# EAGLE design Hocki-Control (EAGLE 9.6.2)
Integrates sensors and microcontroller for battlebot Hocki
REVISION: 1.0; SCH_DESC: Control Board for Hocki Battlebot; TEAM: BattleBots

## Sheet 1 of 4: MCU, I/O, Power
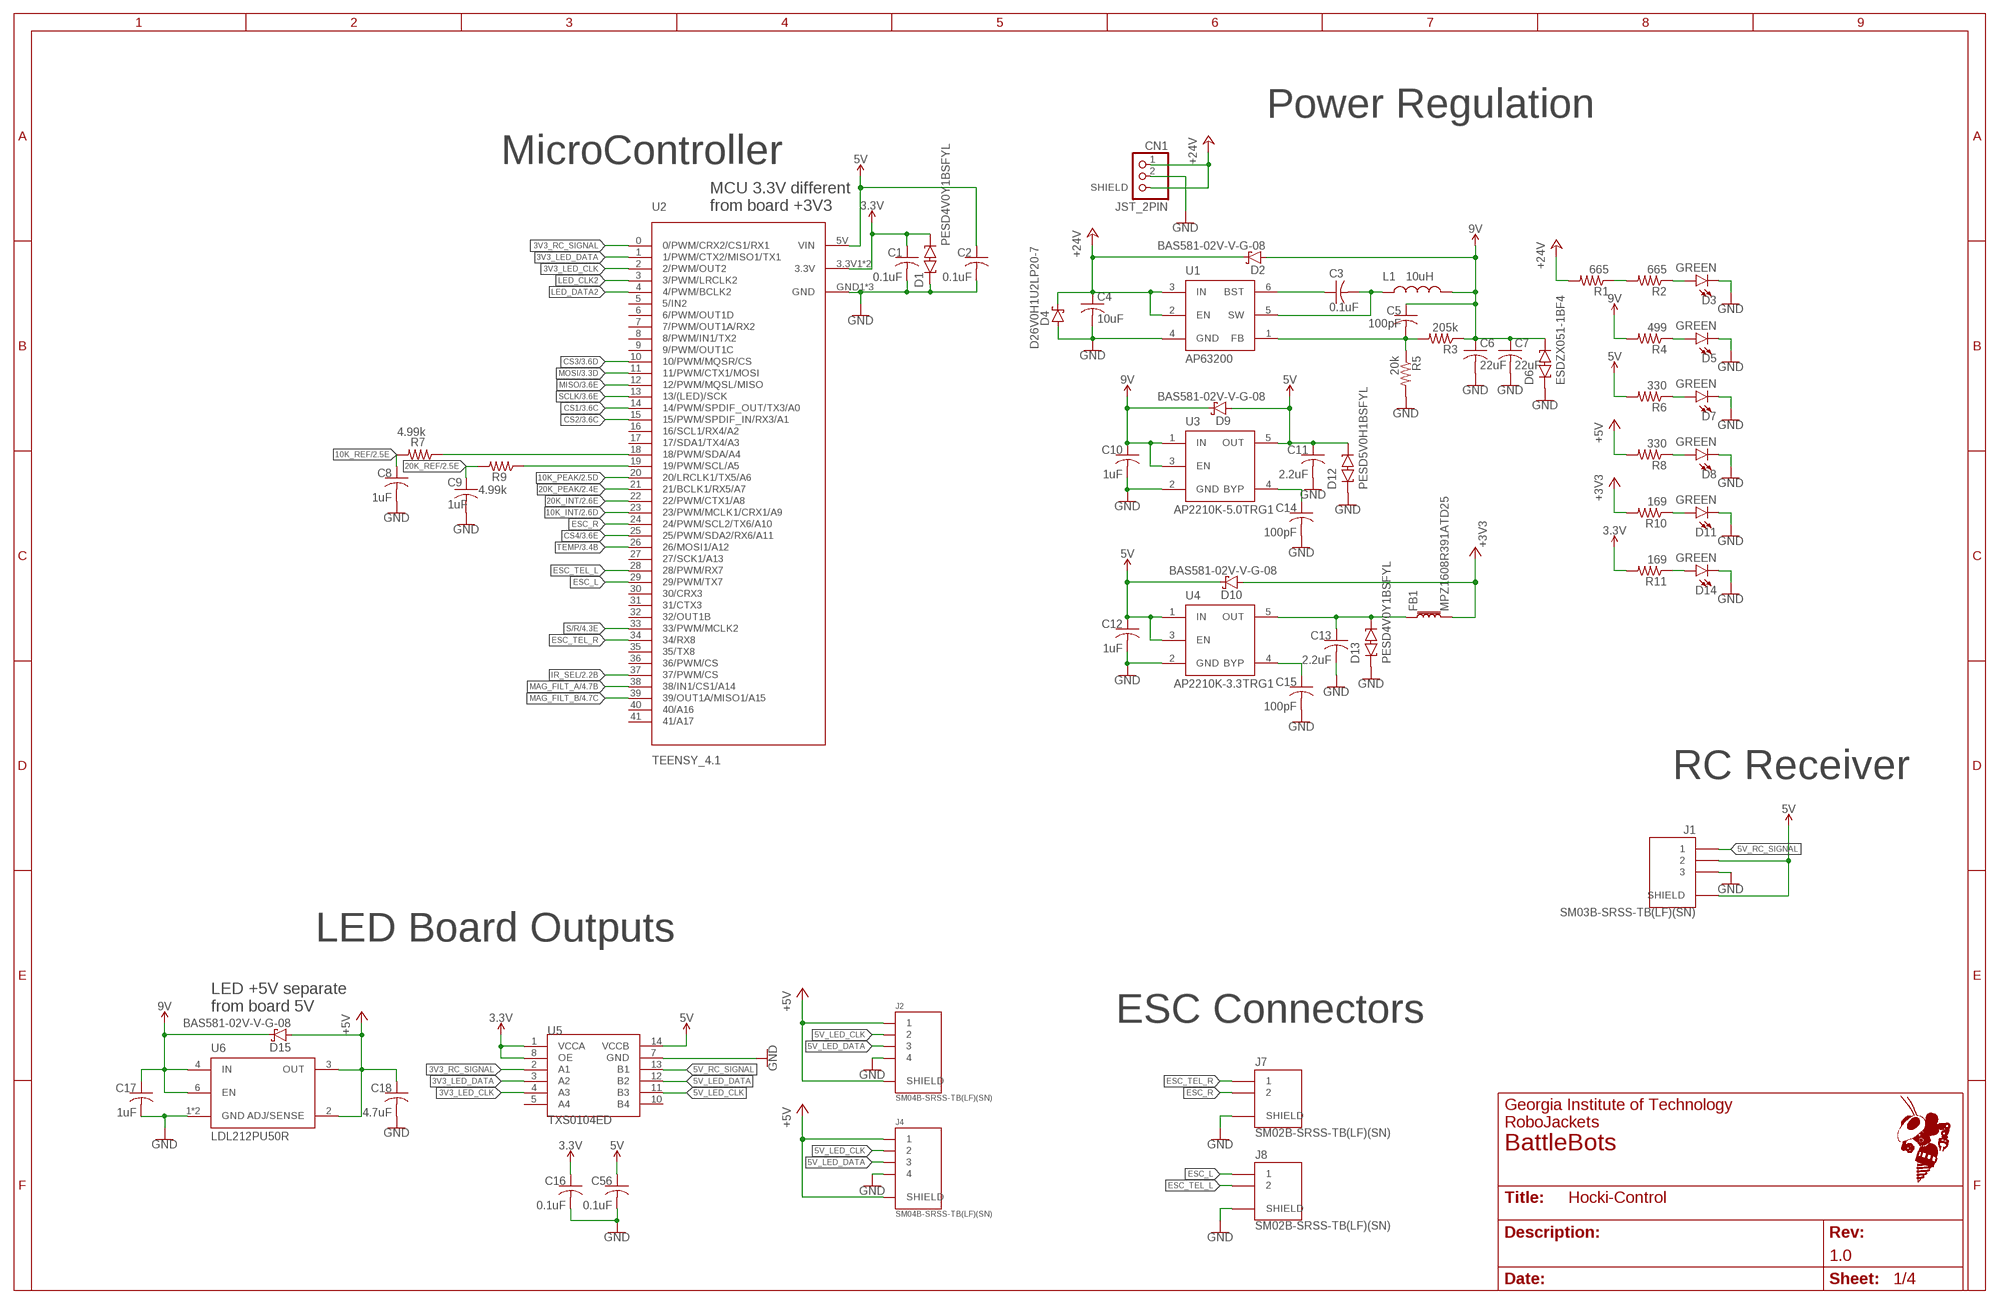
[diagram p0: schematic, sheet 1]

### Parts
C1  0.1uF  C-USC0603  [C0603]
C2  0.1uF  C-USC0603  [C0603]
C3  0.1uF  C-USC0603  [C0603]
C4  10uF  C-USC1206  [C1206]
C5  100pF  C-USC0603  [C0603]
C6  22uF  C-USC1206  [C1206]
C7  22uF  C-USC1206  [C1206]
C8  1uF  C-USC0603  [C0603]
C9  1uF  C-USC0603  [C0603]
C10  1uF  C-USC0603  [C0603]
C11  2.2uF  C-USC0603  [C0603]
C12  1uF  C-USC0603  [C0603]
C13  2.2uF  C-USC0603  [C0603]
C14  100pF  C-USC0603  [C0603]
C15  100pF  C-USC0603  [C0603]
C16  0.1uF  C-USC0603  [C0603]
C17  1uF  C-USC0603  [C0603]
C18  4.7uF  C-USC0603  [C0603]
C56  0.1uF  C-USC0603  [C0603]
CN1  JST_2PIN  [JST-PH-2-SMT]
D1  PESD4V0Y1BSFYL  [DSN0603-2]
D2  BAS581-02V-V-G-08  [SOD-523]
D3  GREEN  LED-GREEN0603  [LED-0603]
D4  D26V0H1U2LP20-7  [D26V0H1U2LP20-7]
D5  GREEN  LED-GREEN0603  [LED-0603]
D6  ESDZX051-1BF4  [DSN0603-2]
D7  GREEN  LED-GREEN0603  [LED-0603]
D8  GREEN  LED-GREEN0603  [LED-0603]
D9  BAS581-02V-V-G-08  [SOD-523]
D10  BAS581-02V-V-G-08  [SOD-523]
D11  GREEN  LED-GREEN0603  [LED-0603]
D12  PESD5V0H1BSFYL  [DSN0603-2]
D13  PESD4V0Y1BSFYL  [DSN0603-2]
D14  GREEN  LED-GREEN0603  [LED-0603]
D15  BAS581-02V-V-G-08  [SOD-523]
FB1  MPZ1608R391ATD25  [0603]
J1  SM03B-SRSS-TB(LF)(SN)  [SM03B-SRSS-TB(LF)(SN)]
J2  SM04B-SRSS-TB(LF)(SN)  [SM04B-SRSS-TB(LF)(SN)]
J4  SM04B-SRSS-TB(LF)(SN)  [SM04B-SRSS-TB(LF)(SN)]
J7  SM02B-SRSS-TB(LF)(SN)  [SM02B-SRSS-TB(LF)(SN)]
J8  SM02B-SRSS-TB(LF)(SN)  [SM02B-SRSS-TB(LF)(SN)]
L1  10uH  LQH5BPN100M38L  [LQH5BPN100M38L]
R1  665  R-US_R0603  [R0603]
R2  665  R-US_R0603  [R0603]
R3  205k  R-US_R0603  [R0603]
R4  499  R-US_R0603  [R0603]
R5  20k  R-US_R0603  [R0603]
R6  330  R-US_R0603  [R0603]
R7  4.99k  R-US_R0603  [R0603]
R8  330  R-US_R0603  [R0603]
R9  4.99k  R-US_R0603  [R0603]
R10  169  R-US_R0603  [R0603]
R11  169  R-US_R0603  [R0603]
U1  AP63200  [SOT-23-6]
U2  TEENSY_4.1  [TEENSY_4.1]
U3  AP2210K-5.0TRG1  [SOT-23-5]
U4  AP2210K-3.3TRG1  [SOT-23-5]
U5  TXS0104ED  [14-SOIC]
U6  LDL212PU50R  [DFN6(3X3)]

### Nets
3.3V: C1.1 C16.1 D1.C2 R11.2 U2.3.3V1(3.3V) U2.3.3V2(3.3V) U5.1(VCCA) U5.8(OE) ; also sheet 2,3
3V3_LED_CLK: U2.2(2/PWM/OUT2) U5.4(A3)
3V3_LED_DATA: U2.1(1/PWM/CTX2/MISO1/TX1) U5.3(A2)
3V3_RC_SIGNAL: U2.0(0/PWM/CRX2/CS1/RX1) U5.2(A1)
5V: C2.1 C11.1 C12.1 C56.1 D9.2(A) D10.1(C) D12.C2 J1.2 J1.S1(SHIELD) J1.S2(SHIELD) R6.2 U2.5V(VIN) U3.5(OUT) U4.1(IN) U4.3(EN) U5.14(VCCB) ; also sheet 2
5V_LED_CLK: J2.2 J4.2 U5.11(B3)
5V_LED_DATA: J2.3 J4.3 U5.12(B2)
5V_RC_SIGNAL: J1.1 U5.13(B1)
9V: C5.1 C6.1 C7.1 C10.1 C17.1 D2.2(A) D6.C2 D9.1(C) D15.1(C) L1.2 R3.1 R4.2 U3.1(IN) U3.3(EN) U6.4(IN) U6.6(EN) ; also sheet 2
10K_INT: U2.23(23/PWM/MCLK1/CRX1/A9) ; also sheet 2
10K_PEAK: U2.20(20/LRCLK1/TX5/A6) ; also sheet 2
10K_REF: C8.1 R7.2 ; also sheet 2
20K_INT: U2.22(22/PWM/CTX1/A8) ; also sheet 2
20K_PEAK: U2.21(21/BCLK1/RX5/A7) ; also sheet 2
20K_REF: C9.1 R9.2 ; also sheet 2
+3V3: D10.2(A) FB1.2 R10.2 ; also sheet 4
+5V: C18.1 D15.2(A) J2.1 J2.S1(SHIELD) J2.S2(SHIELD) J4.1 J4.S1(SHIELD) J4.S2(SHIELD) R8.2 U6.2(ADJ/SENSE) U6.3(OUT)
+24V: C4.1 CN1.1 CN1.NC1(SHIELD) CN1.NC2(SHIELD) D2.1(C) D4.1(C) R1.2 U1.2(EN) U1.3(IN)
CS1: U2.14(14/PWM/SPDIF_OUT/TX3/A0) ; also sheet 3
CS2: U2.15(15/PWM/SPDIF_IN/RX3/A1) ; also sheet 3
CS3: U2.10(10/PWM/MQSR/CS) ; also sheet 3
CS4: U2.25(25/PWM/SDA2/RX6/A11) ; also sheet 3
ESC_L: J8.1 U2.29(29/PWM/TX7)
ESC_R: J7.2 U2.24(24/PWM/SCL2/TX6/A10)
ESC_TEL_L: J8.2 U2.28(28/PWM/RX7)
ESC_TEL_R: J7.1 U2.34(34/RX8)
GND: C1.2 C2.2 C4.2 C6.2 C7.2 C8.2 C9.2 C10.2 C11.2 C12.2 C13.2 C14.2 C15.2 C16.2 C17.2 C18.2 C56.2 CN1.2 D1.C1 D3.C D4.2(A) D5.C D6.C1 D7.C D8.C D11.C D12.C1 D13.C1 D14.C J1.3 J2.4 J4.4 J7.S1(SHIELD) J7.S2(SHIELD) J8.S1(SHIELD) J8.S2(SHIELD) R5.2 U1.4(GND) U2.GND1(GND) U2.GND2(GND) U2.GND3(GND) U3.2(GND) U4.2(GND) U5.7(GND) U6.1(GND) U6.7(GND) ; also sheet 2,3,4
IR_SEL: U2.37(37/PWM/CS) ; also sheet 2
LED_CLK2: U2.3(3/PWM/LRCLK2)
LED_DATA2: U2.4(4/PWM/BCLK2)
MAG_FILT_A: U2.38(38/IN1/CS1/A14) ; also sheet 4
MAG_FILT_B: U2.39(39/OUT1A/MISO1/A15) ; also sheet 4
MISO: U2.12(12/PWM/MQSL/MISO) ; also sheet 3
MOSI: U2.11(11/PWM/CTX1/MOSI) ; also sheet 3
N$1: C3.1 U1.6(BST)
N$3: C3.2 L1.1 U1.5(SW)
N$8: C14.1 U3.4(BYP)
N$11: C15.1 U4.4(BYP)
N$12: C5.2 R3.2 R5.1 U1.1(FB)
N$14: D8.A R8.1
N$15: D7.A R6.1
N$17: D11.A R10.1
N$18: D5.A R4.1
N$19: D3.A R2.1
N$20: R1.1 R2.2
N$21: R7.1 U2.18(18/PWM/SDA/A4)
N$22: R9.1 U2.19(19/PWM/SCL/A5)
N$27: D14.A R11.1
N$28: C13.1 D13.C2 FB1.1 U4.5(OUT)
S/R: U2.33(33/PWM/MCLK2) ; also sheet 4
SCLK: U2.13(13/(LED)/SCK) ; also sheet 3
TEMP: U2.26(26/MOSI1/A12) ; also sheet 3
Unconnected: U2.5(5/IN2) U2.6(6/PWM/OUT1D) U2.7(7/PWM/OUT1A/RX2) U2.8(8/PWM/IN1/TX2) U2.9(9/PWM/OUT1C) U2.16(16/SCL1/RX4/A2) U2.17(17/SDA1/TX4/A3) U2.27(27/SCK1/A13) U2.30(30/CRX3) U2.31(31/CTX3) U2.32(32/OUT1B) U2.35(35/TX8) U2.36(36/PWM/CS) U2.40(40/A16) U2.41(41/A17) U5.5(A4) U5.10(B4)

### Notes on the sheet
- Power Regulation
- MicroController
- MCU 3.3V different
  from board +3V3
- RC Receiver
- LED Board Outputs
- LED +5V separate
  from board 5V
- ESC Connectors

## Sheet 2 of 4: IR Filtering
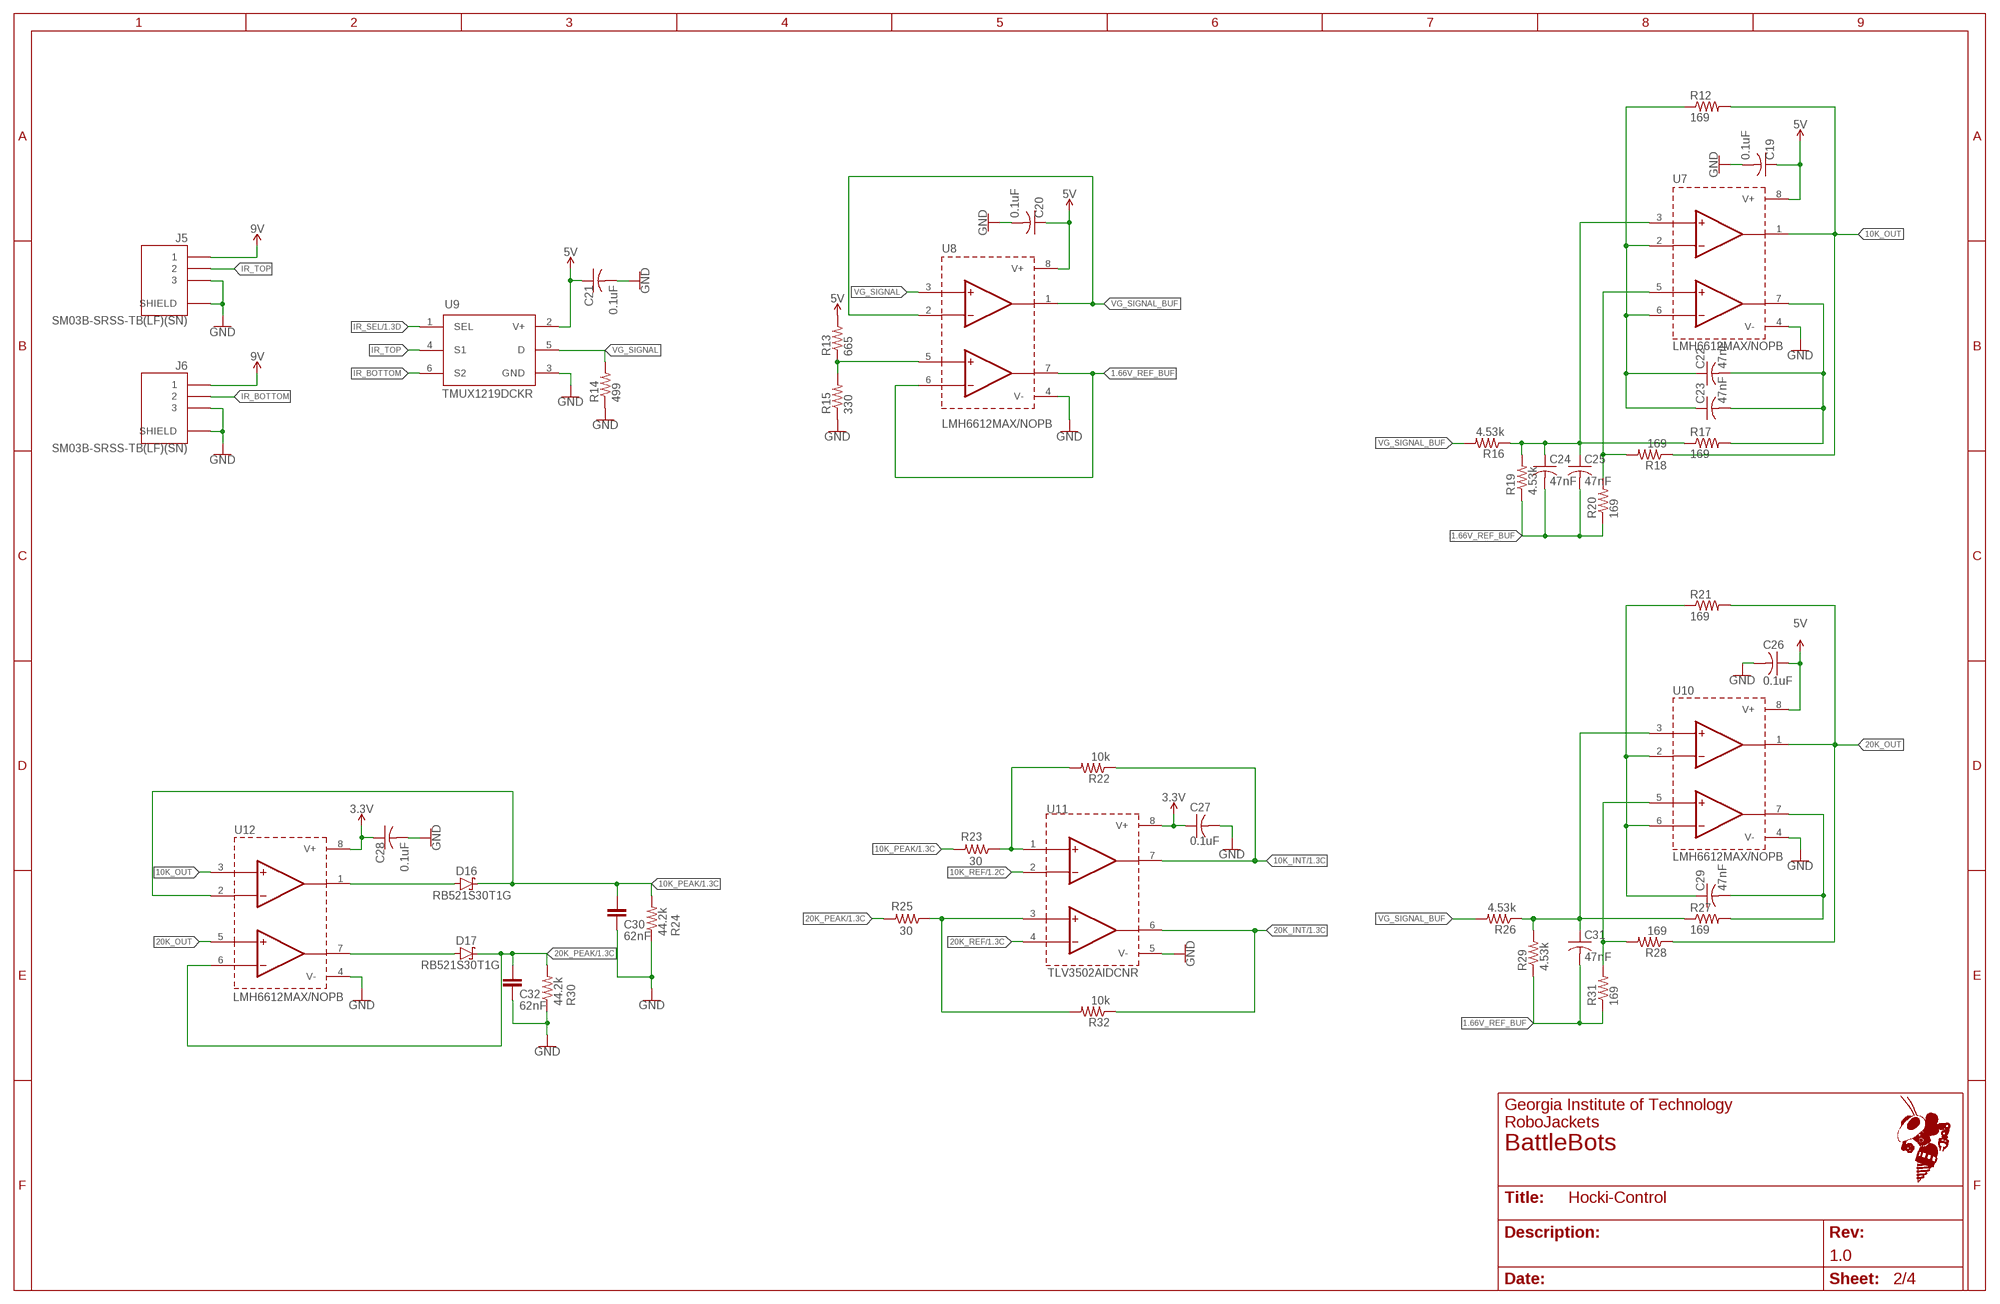
[diagram p1: schematic, sheet 2]

### Parts
C19  0.1uF  C-USC0603  [C0603]
C20  0.1uF  C-USC0603  [C0603]
C21  0.1uF  C-USC0603  [C0603]
C22  47nF  C-USC1206  [C1206]
C23  47nF  C-USC1206  [C1206]
C24  47nF  C-USC1206  [C1206]
C25  47nF  C-USC1206  [C1206]
C26  0.1uF  C-USC0603  [C0603]
C27  0.1uF  C-USC0603  [C0603]
C28  0.1uF  C-USC0603  [C0603]
C29  47nF  C-USC1206  [C1206]
C30  62nF  BFC241646203  [BFC241646203]
C31  47nF  C-USC1206  [C1206]
C32  62nF  BFC241646203  [BFC241646203]
D16  RB521S30T1G  [SOD-523]
D17  RB521S30T1G  [SOD-523]
J5  SM03B-SRSS-TB(LF)(SN)  [SM03B-SRSS-TB(LF)(SN)]
J6  SM03B-SRSS-TB(LF)(SN)  [SM03B-SRSS-TB(LF)(SN)]
R12  169  R-US_R0603  [R0603]
R13  665  R-US_R0603  [R0603]
R14  499  R-US_R0603  [R0603]
R15  330  R-US_R0603  [R0603]
R16  4.53k  R-US_R0603  [R0603]
R17  169  R-US_R0603  [R0603]
R18  169  R-US_R0603  [R0603]
R19  4.53k  R-US_R0603  [R0603]
R20  169  R-US_R0603  [R0603]
R21  169  R-US_R0603  [R0603]
R22  10k  R-US_R0603  [R0603]
R23  30  R-US_R0603  [R0603]
R24  44.2k  R-US_R0603  [R0603]
R25  30  R-US_R0603  [R0603]
R26  4.53k  R-US_R0603  [R0603]
R27  169  R-US_R0603  [R0603]
R28  169  R-US_R0603  [R0603]
R29  4.53k  R-US_R0603  [R0603]
R30  44.2k  R-US_R0603  [R0603]
R31  169  R-US_R0603  [R0603]
R32  10k  R-US_R0603  [R0603]
U7  LMH6612MAX/NOPB  [8-SOIC]
U8  LMH6612MAX/NOPB  [8-SOIC]
U9  TMUX1219DCKR  [SOT-363]
U10  LMH6612MAX/NOPB  [8-SOIC]
U11  TLV3502AIDCNR  [SOT-23-8]
U12  LMH6612MAX/NOPB  [8-SOIC]

### Nets
1.6V_REF: R13.1 R15.2 U8.5(INB+)
1.66V_REF_BUF: C24.2 C25.2 C31.2 R19.1 R20.1 R29.1 R31.1 U8.6(INB-) U8.7(OUTB)
3.3V: C27.1 C28.1 U11.8(V+) U12.8(V+) ; also sheet 1,3
5V: C19.1 C20.1 C21.1 C26.1 R13.2 U7.8(V+) U8.8(V+) U9.2(V+) U10.8(V+) ; also sheet 1
9V: J5.1 J6.1 ; also sheet 1
10K_FB: C22.2 C23.2 R17.2 U7.7(OUTB)
10K_IN: C24.1 C25.1 R16.1 R17.1 R19.2 U7.3(INA+)
10K_INT: R22.1 U11.7(OUTA) ; also sheet 1
10K_OUT: R12.2 R18.1 U7.1(OUTA) U12.3(INA+)
10K_PEAK: C30.1 D16.1(C) R23.2 R24.2 U12.2(INA-) ; also sheet 1
10K_REF: U11.2(INA-) ; also sheet 1
20K_FB: C29.2 R27.2 U10.7(OUTB)
20K_IN: C31.1 R26.1 R27.1 R29.2 U10.3(INA+)
20K_INT: R32.1 U11.6(OUTB) ; also sheet 1
20K_OUT: R21.2 R28.1 U10.1(OUTA) U12.5(INB+)
20K_PEAK: C32.1 D17.1(C) R25.2 R30.2 U12.6(INB-) ; also sheet 1
20K_REF: U11.4(INB-) ; also sheet 1
GND: C19.2 C20.2 C21.2 C26.2 C27.2 C28.2 C30.2 C32.2 J5.3 J5.S1(SHIELD) J5.S2(SHIELD) J6.3 J6.S1(SHIELD) J6.S2(SHIELD) R14.1 R15.1 R24.1 R30.1 U7.4(V-) U8.4(V-) U9.3(GND) U10.4(V-) U11.5(V-) U12.4(V-) ; also sheet 1,3,4
IR_BOTTOM: J6.2 U9.6(S2)
IR_SEL: U9.1(SEL) ; also sheet 1
IR_TOP: J5.2 U9.4(S1)
N$2: D16.2(A) U12.1(OUTA)
N$4: C22.1 C23.1 R12.1 U7.2(INA-) U7.6(INB-)
N$5: R22.2 R23.1 U11.1(INA+)
N$6: R25.1 R32.2 U11.3(INB+)
N$7: R18.2 R20.2 U7.5(INB+)
N$9: D17.2(A) U12.7(OUTB)
N$10: C29.1 R21.1 U10.2(INA-) U10.6(INB-)
N$13: R28.2 R31.2 U10.5(INB+)
VG_SIGNAL: R14.2 U8.3(INA+) U9.5(D)
VG_SIGNAL_BUF: R16.2 R26.2 U8.1(OUTA) U8.2(INA-)

## Sheet 3 of 4: Accelerometers
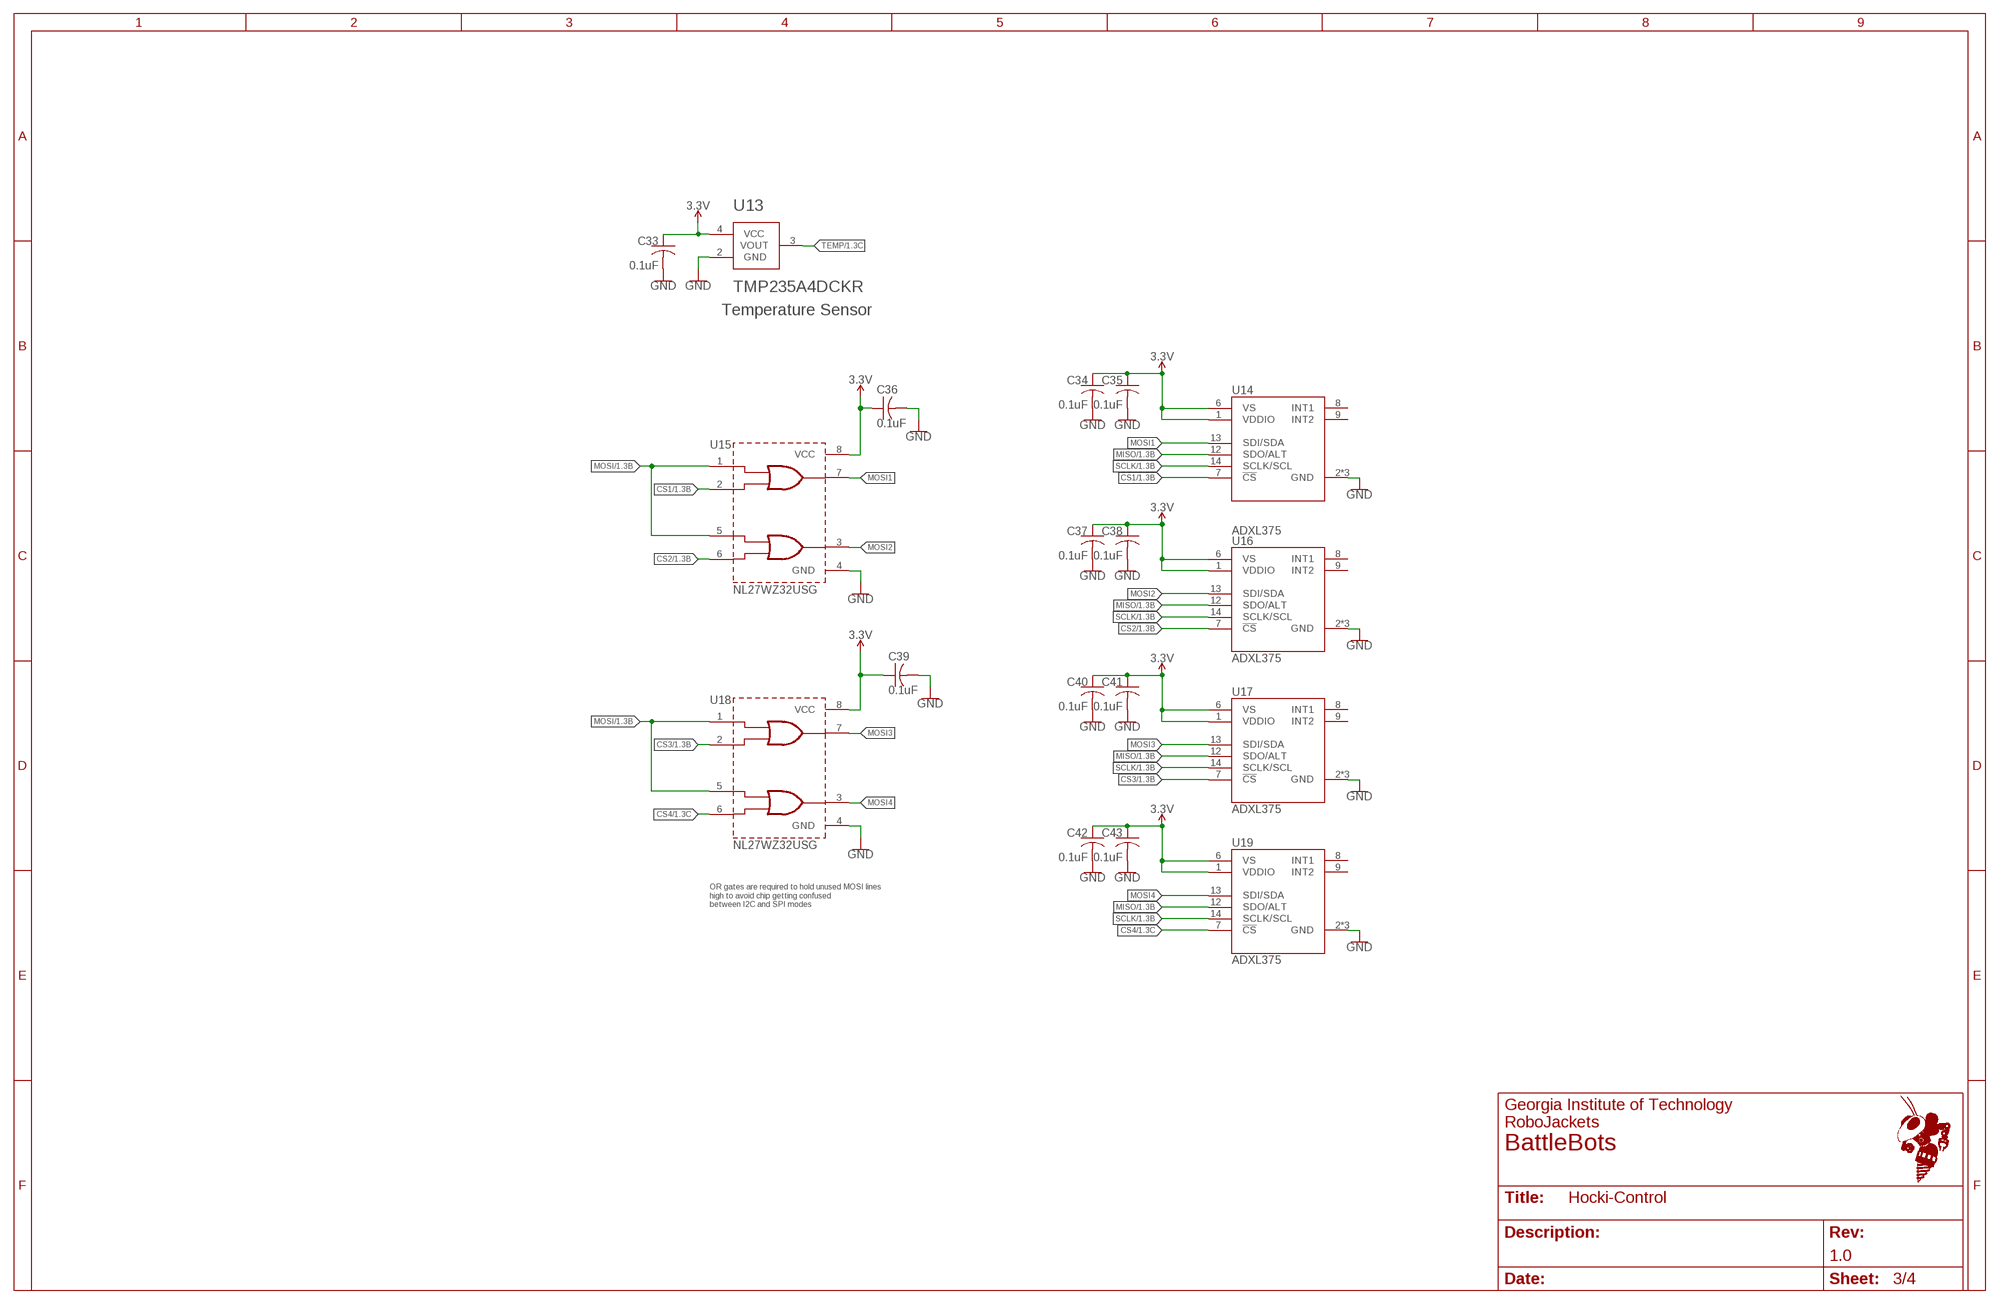
[diagram p2: schematic, sheet 3]

### Parts
C33  0.1uF  C-USC0603  [C0603]
C34  0.1uF  C-USC0603  [C0603]
C35  0.1uF  C-USC0603  [C0603]
C36  0.1uF  C-USC0603  [C0603]
C37  0.1uF  C-USC0603  [C0603]
C38  0.1uF  C-USC0603  [C0603]
C39  0.1uF  C-USC0603  [C0603]
C40  0.1uF  C-USC0603  [C0603]
C41  0.1uF  C-USC0603  [C0603]
C42  0.1uF  C-USC0603  [C0603]
C43  0.1uF  C-USC0603  [C0603]
U13  TMP235A4DCKR  [SOT-353]
U14  ADXL375  [14-LGA]
U15  NL27WZ32USG  [US8]
U16  ADXL375  [14-LGA]
U17  ADXL375  [14-LGA]
U18  NL27WZ32USG  [US8]
U19  ADXL375  [14-LGA]

### Nets
3.3V: C33.1 C34.1 C35.1 C36.1 C37.1 C38.1 C39.1 C40.1 C41.1 C42.1 C43.1 U13.4(VCC) U14.1(VDDIO) U14.6(VS) U15.8(VCC) U16.1(VDDIO) U16.6(VS) U17.1(VDDIO) U17.6(VS) U18.8(VCC) U19.1(VDDIO) U19.6(VS) ; also sheet 1,2
CS1: U14.7(!CS) U15.2(B1) ; also sheet 1
CS2: U15.6(B2) U16.7(!CS) ; also sheet 1
CS3: U17.7(!CS) U18.2(B1) ; also sheet 1
CS4: U18.6(B2) U19.7(!CS) ; also sheet 1
GND: C33.2 C34.2 C35.2 C36.2 C37.2 C38.2 C39.2 C40.2 C41.2 C42.2 C43.2 U13.2(GND) U14.2(GND) U14.4(GND) U14.5(GND) U15.4(GND) U16.2(GND) U16.4(GND) U16.5(GND) U17.2(GND) U17.4(GND) U17.5(GND) U18.4(GND) U19.2(GND) U19.4(GND) U19.5(GND) ; also sheet 1,2,4
MISO: U14.12(SDO/ALT) U16.12(SDO/ALT) U17.12(SDO/ALT) U19.12(SDO/ALT) ; also sheet 1
MOSI: U15.1(A1) U15.5(A2) U18.1(A1) U18.5(A2) ; also sheet 1
MOSI1: U14.13(SDI/SDA) U15.7(Y1)
MOSI2: U15.3(Y2) U16.13(SDI/SDA)
MOSI3: U17.13(SDI/SDA) U18.7(Y1)
MOSI4: U18.3(Y2) U19.13(SDI/SDA)
SCLK: U14.14(SCLK/SCL) U16.14(SCLK/SCL) U17.14(SCLK/SCL) U19.14(SCLK/SCL) ; also sheet 1
TEMP: U13.3(VOUT) ; also sheet 1
Unconnected: U14.8(INT1) U14.9(INT2) U16.8(INT1) U16.9(INT2) U17.8(INT1) U17.9(INT2) U19.8(INT1) U19.9(INT2)

### Notes on the sheet
- Temperature Sensor
- OR gates are required to hold unused MOSI lines 
  high to avoid chip getting confused 
  between I2C and SPI modes

## Sheet 4 of 4: Magnetometer
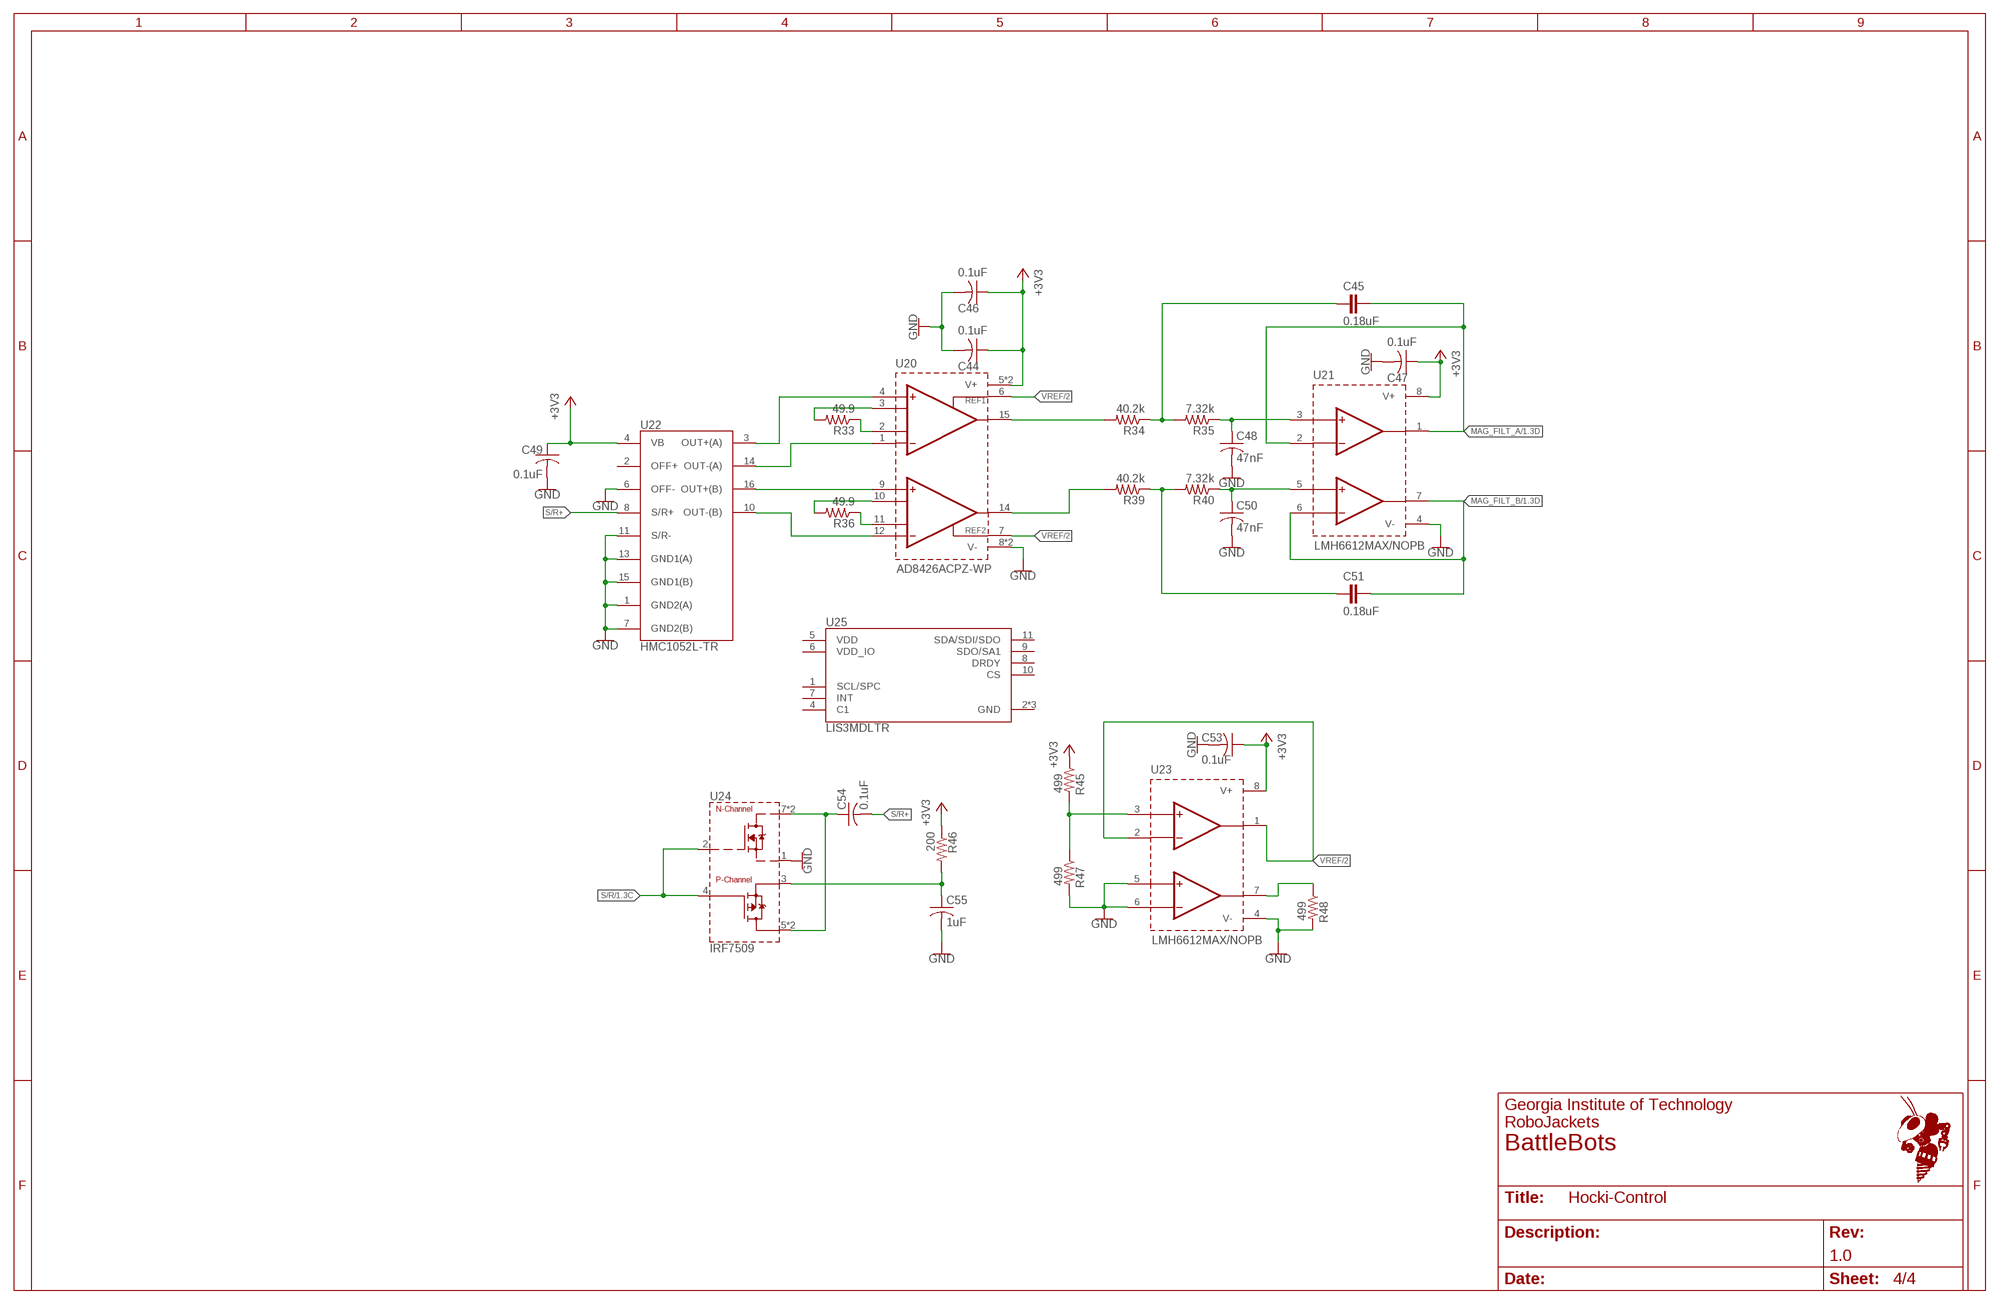
[diagram p3: schematic, sheet 4]

### Parts
C44  0.1uF  C-USC0603  [C0603]
C45  0.18uF  ECH-U1H184GX9  [ECH-U1H184GX9]
C46  0.1uF  C-USC0603  [C0603]
C47  0.1uF  C-USC0603  [C0603]
C48  47nF  C-USC1206  [C1206]
C49  0.1uF  C-USC0603  [C0603]
C50  47nF  C-USC1206  [C1206]
C51  0.18uF  ECH-U1H184GX9  [ECH-U1H184GX9]
C53  0.1uF  C-USC0603  [C0603]
C54  0.1uF  C-USC0603  [C0603]
C55  1uF  C-USC0603  [C0603]
R33  49.9  R-US_R0603  [R0603]
R34  40.2k  R-US_R0603  [R0603]
R35  7.32k  R-US_R0603  [R0603]
R36  49.9  R-US_R0603  [R0603]
R39  40.2k  R-US_R0603  [R0603]
R40  7.32k  R-US_R0603  [R0603]
R45  499  R-US_R0603  [R0603]
R46  200  R-US_R0603  [R0603]
R47  499  R-US_R0603  [R0603]
R48  499  R-US_R0603  [R0603]
U20  AD8426ACPZ-WP  [16LFCSP]
U21  LMH6612MAX/NOPB  [8-SOIC]
U22  HMC1052L-TR  [16-LCC]
U23  LMH6612MAX/NOPB  [8-SOIC]
U24  IRF7509  [MICRO8]
U25  LIS3MDLTR  [LGA-12_2X2X1_STM]

### Nets
+3V3: C44.1 C46.1 C47.1 C49.1 C53.1 R45.1 R46.1 U20.5(V+) U20.16(V+) U21.8(V+) U22.4(VB) U23.8(V+) ; also sheet 1
GND: C44.2 C46.2 C47.2 C48.2 C49.2 C50.2 C53.2 C55.2 R47.2 R48.2 U20.8(V-) U20.13(V-) U21.4(V-) U22.1(GND2(A)) U22.6(OFF-) U22.7(GND2(B)) U22.11(S/R-) U22.13(GND1(A)) U22.15(GND1(B)) U23.4(V-) U23.5(INB+) U23.6(INB-) U24.1(S1) ; also sheet 1,2,3
MAG_FILT_A: C45.2 U21.1(OUTA) U21.2(INA-) ; also sheet 1
MAG_FILT_B: C51.2 U21.6(INB-) U21.7(OUTB) ; also sheet 1
N$16: C54.1 U24.5(D2) U24.6(D2) U24.7(D1) U24.8(D1)
N$23: R45.2 R47.1 U23.3(INA+)
N$24: R48.1 U23.7(OUTB)
N$25: C45.1 R34.1 R35.2
N$26: C48.1 R35.1 U21.3(INA+)
N$29: C51.1 R39.1 R40.2
N$30: C50.1 R40.1 U21.5(INB+)
N$31: U20.4(INA+) U22.3(OUT+(A))
N$32: U20.1(INA-) U22.14(OUT-(A))
N$33: U20.9(INB+) U22.16(OUT+(B))
N$34: U20.12(INB-) U22.10(OUT-(B))
N$35: R39.2 U20.14(OUTB)
N$36: R34.2 U20.15(OUTA)
N$37: R33.2 U20.3(RGA+)
N$38: R33.1 U20.2(RGA-)
N$39: R36.2 U20.10(RGB+)
N$40: R36.1 U20.11(RGB-)
S/R: U24.2(G1) U24.4(G2) ; also sheet 1
S/R+: C54.2 U22.8(S/R+)
VREF/2: U20.6(REFA) U20.7(REFB) U23.1(OUTA) U23.2(INA-)
VSR: C55.1 R46.2 U24.3(S2)
Unconnected: U22.2(OFF+) U25.1(SCL/SPC) U25.2(GND) U25.3(GND) U25.4(C1) U25.5(VDD) U25.6(VDD_IO) U25.7(INT) U25.8(DRDY) U25.9(SDO/SA1) U25.10(CS) U25.11(SDA/SDI/SDO) U25.12(GND)

## Library data of the parts
C1-C29 C31 C33-C44 C46-C50 C53-C56 = rcl:C-US: CAPACITOR, American symbol; SPICEPREFIX: C
C30 C32 = Hocki_Library:BFC241646203: 0.062µF Film Capacitor 25V 63V Polypropylene (PP), Metallized Radial DigiKey <https://www.digikey.com/product-detail/en/vishay-bc-components/BFC241646203/BC2071-ND/502851>; DKPN: BC2071-ND; VALUE: 62n
C45 C51 = Hocki_Library:ECH-U1H184GX9: 0.18µF Film Capacitor 50V Polyphenylene Sulfide (PPS), Metallized - Stacked 2416 (6041 Metric) DigiKey <https://www.digikey.com/product-detail/en/panasonic-electronic-components/ECH-U1H184GX9/PCF1555CT-ND/1630918>; DKPN: PCF1555CT-ND; VALUE: 0.18u
CN1 = Hocki_Library:JST_2PIN: JST 2-Pin Connectors of various flavors SMT-RA (S2B-PH-SM4) 4UConnector #17311 SMT (B2B-PH-SM4) THM-RA (S2B-PH) THM (B2B-PH)
D1 D13 = Hocki_Library:PESD4V0Y1BSFYL: 3.7V (Typ) Clamp Ipp Tvs Diode Surface Mount DSN0603-2 DigiKey <https://www.digikey.com/product-detail/en/nexperia-usa-inc/PESD4V0Y1BSFYL/1727-7840-1-ND/9326518>; DKPN: 1727-7840-1-ND
D2 D9 D10 D15 = Hocki_Library:BAS581-02V-V-G-08: Diode Schottky 40V 200mA Surface Mount SOD-523 DigiKey <https://www.digikey.com/product-detail/en/vishay-semiconductor-diodes-division/BAS581-02V-V-G-08/112-BAS581-02V-V-G-08CT-ND/8564684>; DKPN: 112-BAS581-02V-V-G-08CT-ND
D3 D5 D7 D8 D11 D14 = SparkFun-LED:LED-GREEN: Green SMD LED Used in manufacturing of various products at SparkFun Packages: 0603 - SMD 0603 package [Product Link] <http://www.futureelectronics.com/en/technologies/semiconductors/optoelectronics/leds/Pages/9894312-LTST-C190GKT.aspx?CrossPart=HSMG-C190&IM=0> LilyPad 1206 - SMD1206 LilyPad package [Product Link] <http://www.futureelectronics.com/en/Technologies/Product.aspx?ProductID=IN150NGHARVATEKCORPORATION2049943&IM=0> 1206 - SMD1206 package [Product Link] <http://www.futureelectronics.com/en/technologies/semiconductors/optoelectronics/leds/Pages/8315665-LTST-C150KGKT.aspx?IM=0> 1206 Bottom Mount -SMD 1206 Bottom Mount [Product Link] <http://www.digikey.com/product-detail/en/lite-on-inc/LTST-C230KGKT/160-1456-1-ND/386854> SparkFun Products: Pro Mini 328 -5V <https://www.sparkfun.com/products/821> RedBoard <https://www.sparkfun.com/products/12757> MP3 Trigger <https://www.sparkfun.com/products/13720> Makey Makey <https://www.sparkfun.com/products/11076>; PROD_ID: DIO-00821
D4 = Hocki_Library:D26V0H1U2LP20-7: 40V Clamp 9.5A Ipp Tvs Diode Surface Mount U-DFN2020-2 DigiKey <https://www.digikey.com/product-detail/en/diodes-incorporated/D26V0H1U2LP20-7/D26V0H1U2LP20-7DICT-ND/4898881>
D6 = Hocki_Library:ESDZX051-1BF4: 10V (Typ) Clamp 4A (8/20µs) Ipp Tvs Diode Surface Mount ST0201 DigiKey <https://www.digikey.com/product-detail/en/stmicroelectronics/ESDZX051-1BF4/497-ESDZX051-1BF4CT-ND/12749584>; DKPN: 497-ESDZX051-1BF4CT-ND
D12 = Hocki_Library:PESD5V0H1BSFYL: 5V Clamp 7A (8/20µs) Ipp Tvs Diode Surface Mount DSN0603-2 DigiKey <https://www.digikey.com/product-detail/en/nexperia-usa-inc/PESD5V0H1BSFYL/1727-2675-1-ND/6576108>; DKPN: 1727-2675-1-ND
D16 D17 = Hocki_Library:RB521S30T1G
FB1 = Hocki_Library:MPZ1608R391ATD25: FERRITE BEAD 390 OHM 0603 1LN DigiKey <https://www.digikey.com/en/products/detail/tdk-corporation/MPZ1608R391ATD25/5040311>; DKPN: 445-172888-1-ND
J1 J5 J6 = Hocki_Library:SM03B-SRSS-TB(LF)(SN): Connector Header Surface Mount, Right Angle 3 position 0.039" (1.00mm) DigiKey <https://www.digikey.com/product-detail/en/jst-sales-america-inc/SM03B-SRSS-TB-LF-SN/455-1803-1-ND/926874>; DKPN: 455-1803-1-ND
J2 J4 = Hocki_Library:SM04B-SRSS-TB(LF)(SN): Connector Header Surface Mount, Right Angle 4 position 0.039" (1.00mm) DigiKey <https://www.digikey.com/product-detail/en/jst-sales-america-inc/SM04B-SRSS-TB-LF-SN/455-1804-1-ND/926875>; DKPN: 455-1804-1-ND
J7 J8 = Hocki_Library:SM02B-SRSS-TB(LF)(SN): Connector Header Surface Mount, Right Angle 2 position 0.039" (1.00mm) DigiKey <https://www.digikey.com/product-detail/en/jst-sales-america-inc/SM02B-SRSS-TB-LF-SN/455-1802-1-ND/926873>; DKPN: 455-1802-1-ND
L1 = Hocki_Library:LQH5BPN100M38L: 10µH Shielded Wirewound Inductor 2.2A 56mOhm Nonstandard DigiKey <https://www.digikey.com/product-detail/en/murata-electronics/LQH5BPN100M38L/490-16631-1-ND/7595555>; DKPN: 490-16631-1-ND
R1-R36 R39 R40 R45-R48 = rcl:R-US_: RESISTOR, American symbol; SPICEPREFIX: R
U1 = Hocki_Library:AP6320*: Buck Switching Regulator IC Positive Adjustable 1.2V 1 Output 2A SOT-23-6 Thin, TSOT-23-6 DigiKey <https://www.digikey.com/product-detail/en/diodes-incorporated/AP63200WU-7/AP63200WU-7DICT-ND/9858427>; DKPN: AP63200WU-7DICT-ND
U2 = Hocki_Library:TEENSY_4.1: Teensy 4.1 features the fastest micocontroller and an expanded set of powerful peripherals in a 2.4 by 0.7 inch form factor. DigiKey <https://www.digikey.com/product-detail/en/sparkfun-electronics/DEV-16771/1568-DEV-16771-ND/12180099>; DKPN: 1568-DEV-16771-ND
U3 = Hocki_Library:AP2210K-*TRG1: Linear Voltage Regulator IC 1 Output 300mA SOT-23-5 3.3V DigiKey <https://www.digikey.com/product-detail/en/diodes-incorporated/AP2210K-3-3TRG1/AP2210K-3-3TRG1DICT-ND/4505291> 5.0V DigiKey <https://www.digikey.com/product-detail/en/diodes-incorporated/AP2210K-5-0TRG1/AP2210K-5-0TRG1DICT-ND/4505292>; DKPN: AP2210K-5.0TRG1DICT-ND
U4 = Hocki_Library:AP2210K-*TRG1: Linear Voltage Regulator IC 1 Output 300mA SOT-23-5 3.3V DigiKey <https://www.digikey.com/product-detail/en/diodes-incorporated/AP2210K-3-3TRG1/AP2210K-3-3TRG1DICT-ND/4505291> 5.0V DigiKey <https://www.digikey.com/product-detail/en/diodes-incorporated/AP2210K-5-0TRG1/AP2210K-5-0TRG1DICT-ND/4505292>; DKPN: AP2210K-3.3TRG1DICT-ND
U5 = Hocki_Library:TXS0104ED: Translator 1 Circuit, 4 Channel Bidirectional DigiKey <https://www.digikey.com/en/products/detail/texas-instruments/TXS0104ED/1910175>; DKPN: 296-34699-5-ND
U6 = Hocki_Library:LDL212PU50R: Linear Voltage Regulator IC 1 Output 1.2A 6-DFN (3x3) DigiKey <https://www.digikey.com/product-detail/en/stmicroelectronics/LDL212PU50R/497-16897-1-ND/6230213>; DKPN: 497-16897-1-ND
U7 U8 U10 U12 U21 U23 = Hocki_Library:LMH6612MAX/NOPB: General Purpose Amplifier 2 Circuit Rail-to-Rail 8-SOIC DigiKey <https://www.digikey.com/product-detail/en/texas-instruments/LMH6612MAX-NOPB/296-46310-1-ND/7033484>; DKPN: 296-46310-1-ND
U9 = Hocki_Library:TMUX1219DCKR: 1 Circuit IC Switch 2:1 3Ohm (Typ) SC-70-6 DigiKey <https://www.digikey.com/products/en/integrated-circuits-ics/interface-analog-switches-multiplexers-demultiplexers/747?k=tmux1219&k=&pkeyword=tmux1219&sv=0&pv7=2&sf=0&quantity=&ColumnSort=0&page=1&pageSize=25>; DKPN: 296-TMUX1219DCKRCT-ND
U11 = Hocki_Library:TLV3502AIDCNR: Comparator General Purpose CMOS, Push-Pull, Rail-to-Rail, TTL SOT-23-8 DigiKey <https://www.digikey.com/product-detail/en/texas-instruments/TLV3502AIDCNR/296-39267-1-ND/5143259>; DKPN: 296-39267-1-ND
U13 = Hocki_Library:TMP235A4DCKR: Temperature Sensor Analog, Local -40°C ~ 150°C 10mV/°C SC-70-5 DigiKey <https://www.digikey.com/product-detail/en/texas-instruments/TMP235A4DCKR/296-50016-1-ND/9462854>
U14 U16 U17 U19 = Hocki_Library:ADXL375: Accelerometer X, Y, Z Axis ±200g 0.05Hz ~ 1.6kHz 14-LGA (3x5) DigiKey <https://www.digikey.com/product-detail/en/analog-devices-inc/ADXL375BCCZ-RL7/ADXL375BCCZ-RL7CT-ND/4376405>; DKPN: ADXL375BCCZ-RL7CT-ND
U15 U18 = Hocki_Library:NL27WZ32USG: OR Gate IC 2 Channel US8 DigiKey <https://www.digikey.com/product-detail/en/on-semiconductor/NL27WZ32USG/NL27WZ32USGOSCT-ND/964591>; DKPN: NL27WZ32USGOSCT-ND
U20 = Hocki_Library:AD8426ACPZ-WP: IC INST AMP 2 CIRCUIT 16LFCSP DigiKey <https://www.digikey.com/en/products/detail/analog-devices-inc/AD8426ACPZ-WP/2742222>; DKPN: AD8426ACPZ-WP-ND
U22 = Hocki_Library:HMC1052L-TR: Magnetoresistive Sensor X, Y Axis 16-LCC DigiKey <https://www.digikey.com/en/products/detail/honeywell-aerospace/HMC1052L-TR/2512744>; DKPN: 342-1042-2-ND
U24 = Hocki_Library:IRF7509: Dual N and P Channel MOSFET DigiKey <https://www.digikey.com/product-detail/en/infineon-technologies/IRF7509TR/IRF7509CT-ND/354717>; DKPN: IRF7509CT-ND
U25 = Hocki_Library:LIS3MDLTR: Magnetoresistive Sensor X, Y, Z Axis 12-LGA (2x2) https://www.st.com/content/ccc/resource/technical/document/datasheet/54/2a/85/76/e3/97/42/18/DM00075867.pdf/files/DM00075867.pdf/jcr:content/translations/en.DM00075867.pdf; DKPN: 497-13892-1-ND

## Board
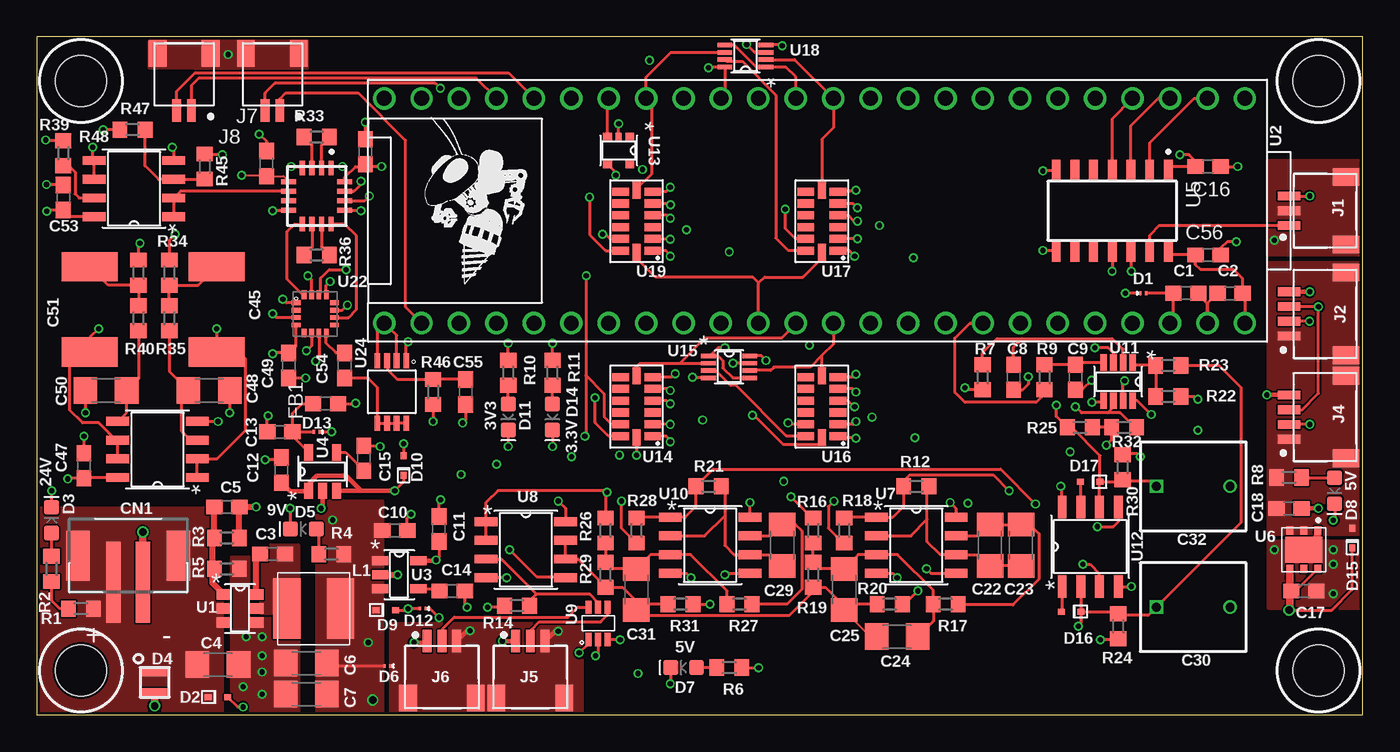
[diagram p4: board, top side]
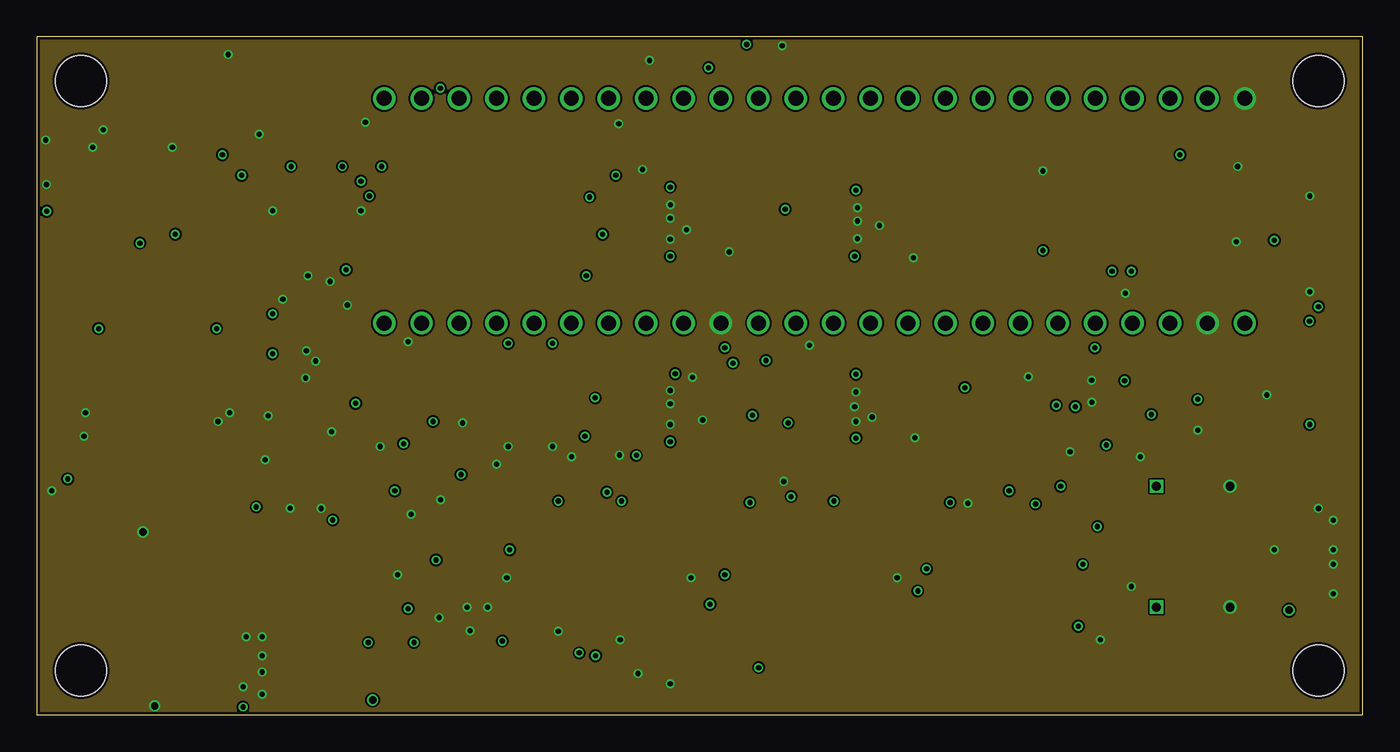
[diagram p5: board, inner layer GND]
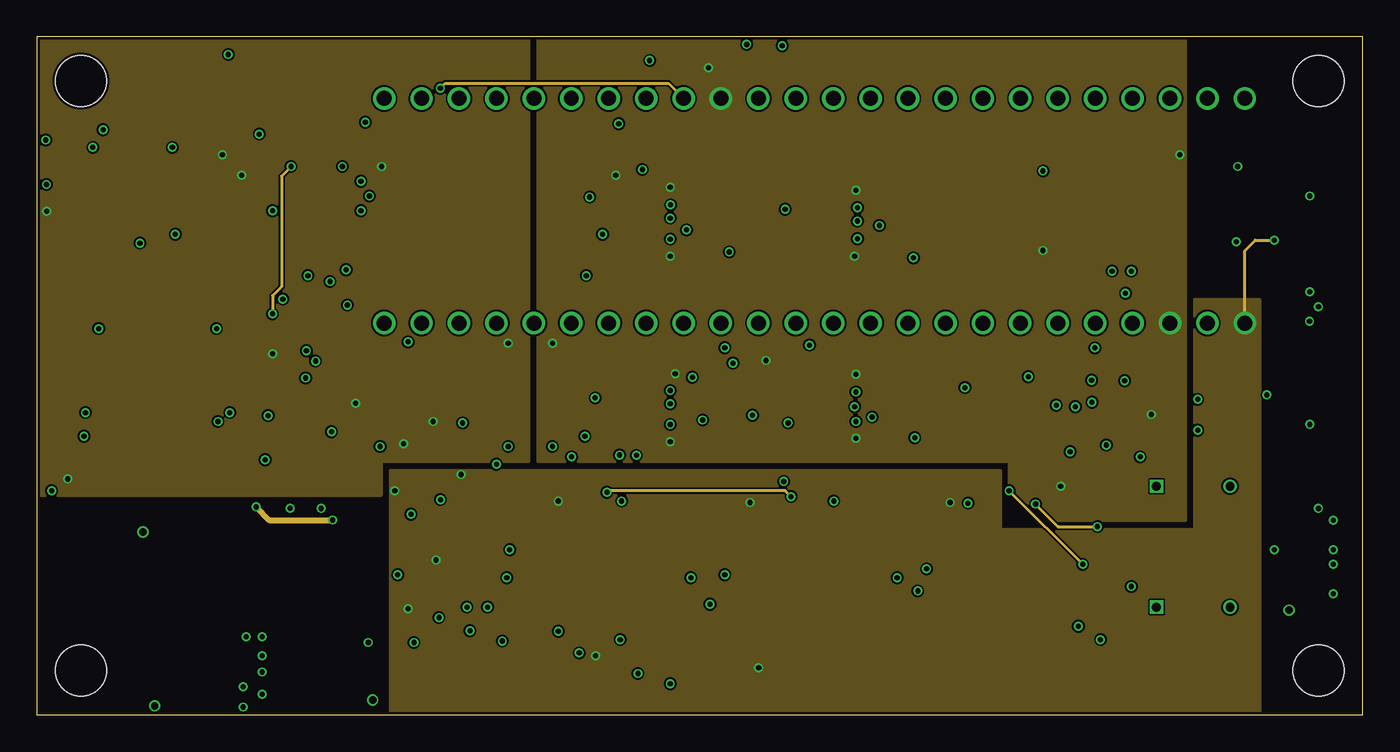
[diagram p6: board, inner layer Power]
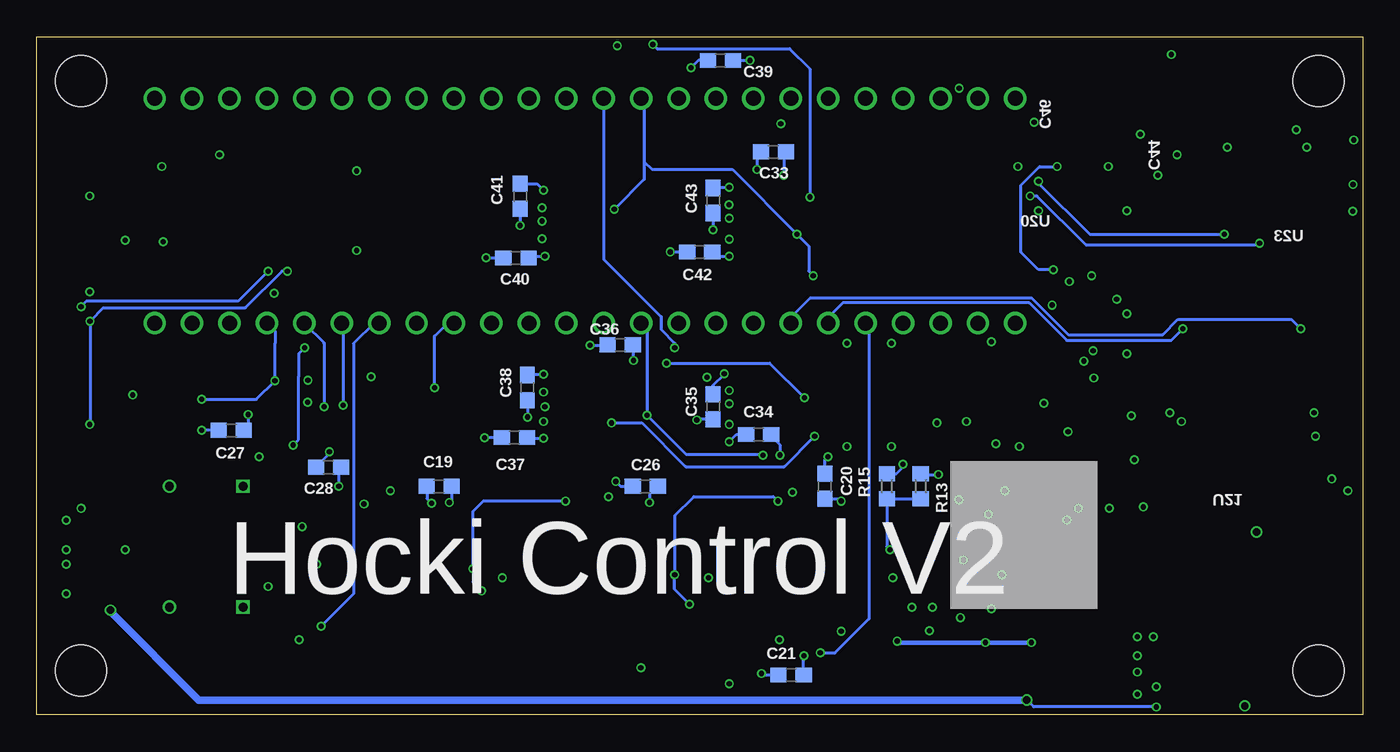
[diagram p7: board, bottom side, seen from below]

Size 90 x 46 mm. Coordinates in mm from the lower left corner, seen from the top.
Outline: 0,46 0,0 90,0 90,46 0,46
Copper layers (1+2*15+16): Top 0.035mm / dielectric 0.2mm / GND 0.0175mm / dielectric 1.065mm / Power 0.0175mm / dielectric 0.2mm / Bottom 0.035mm
Design rules "JLCPCB (4 Layer)": minimum track width 5mil, minimum drill 0.2mm, track to track 5mil, track to pad 5mil, pad to pad 5mil, via to via 20mil, smd to smd 5mil, copper to edge 0.2mm, drill to drill 21mil, minimum pad ring 6mil, minimum via ring 5mil, stop-mask expansion 6mil, vias tented up to drill 30mil, thermal gap 10mil
Holes 3.45 mm at 87,43 87,3 3,3 3,43

### Footprints (pad centres in the part's own frame; a part is rotated, then mirrored left to right if it is on the bottom)
C0603 = smd 1.1 x 1: 1 -0.85,0; 2 0.85,0
C1206 = smd 1.6 x 1.8: 1 -1.4,0; 2 1.4,0
BFC241646203 = drill 0.6 square: 1 -2.5,0 | drill 0.6: 2 2.5,0
ECH-U1H184GX9 = smd 2 x 3.8: 1 -2.9,0; 2 2.9,0
JST-PH-2-SMT = smd 1 x 5.5: 1 -1,-1.8; 2 1,-1.8 | smd 1.6 x 3.4: NC1 -3.4,0; NC2 3.4,0
DSN0603-2 = smd 0.15 x 0.25: C1 -0.2,0; C2 0.2,0
SOD-523 = smd 0.48 x 0.4: 1 -0.66,0; 2 0.66,0
LED-0603 = smd 1 x 1: A -0.877,0; C 0.877,0
D26V0H1U2LP20-7 = smd 0.55 x 1.9: 1 -0.675,0; 2 0.675,0
0603 = smd 1.1 x 1: 1 -0.85,0; 2 0.85,0
SM03B-SRSS-TB(LF)(SN) = smd 0.6 x 1.55: 1 -1,0; 2 0,0; 3 1,0 | smd 1.2 x 1.8: S1 -2.3,-3.875; S2 2.3,-3.875
SM04B-SRSS-TB(LF)(SN) = smd 0.6 x 1.55: 1 -1.5,0; 2 -0.5,0; 3 0.5,0; 4 1.5,0 | smd 1.2 x 1.8: S1 -2.8,-3.875; S2 2.8,-3.875
SM02B-SRSS-TB(LF)(SN) = smd 0.6 x 1.55: 1 -0.5,0; 2 0.5,0 | smd 1.2 x 1.8: S1 -1.8,-3.875; S2 1.8,-3.875
LQH5BPN100M38L = smd 1.85 x 4.1: 1 -1.825,0; 2 1.825,0
R0603 = smd 1 x 1.1: 1 -0.85,0; 2 0.85,0
SOT-23-6 = smd 1 x 0.7: 1 -1.1,0.95; 2 -1.1,0; 3 -1.1,-0.95; 4 1.1,-0.95; 5 1.1,0; 6 1.1,0.95
TEENSY_4.1 = drill 1.016: 0 -7.62,27.46; 1 -7.62,24.92; 2 -7.62,22.38; 3 -7.62,19.84; 3.3V1 -7.62,-5.56; 3.3V2 7.62,24.92; 4 -7.62,17.3; 5 -7.62,14.76; 5V 7.62,30; 6 -7.62,12.22; 7 -7.62,9.68; 8 -7.62,7.14; 9 -7.62,4.6; 10 -7.62,2.06; 11 -7.62,-0.48; 12 -7.62,-3.02; 13 7.62,-3.02; 14 7.62,-0.48; 15 7.62,2.06; 16 7.62,4.6; 17 7.62,7.14; 18 7.62,9.68; 19 7.62,12.22; 20 7.62,14.76; 21 7.62,17.3; 22 7.62,19.84; 23 7.62,22.38; 24 -7.62,-8.1; 25 -7.62,-10.64; 26 -7.62,-13.18; 27 -7.62,-15.72; 28 -7.62,-18.26; 29 -7.62,-20.8; 30 -7.62,-23.34; 31 -7.62,-25.88; 32 -7.62,-28.42; 33 7.62,-28.42; 34 7.62,-25.88; 35 7.62,-23.34; 36 7.62,-20.8; 37 7.62,-18.26; 38 7.62,-15.72; 39 7.62,-13.18; 40 7.62,-10.64; 41 7.62,-8.1; GND1 -7.62,30; GND2 7.62,27.46; GND3 7.62,-5.56
SOT-23-5 = smd 1.1 x 0.6: 1 -1.3,0.95; 2 -1.3,0; 3 -1.3,-0.95; 4 1.3,-0.95; 5 1.3,0.95
14-SOIC = smd 1.55 x 0.6: 1 -2.7,3.81; 2 -2.7,2.54; 3 -2.7,1.27; 4 -2.7,0; 5 -2.7,-1.27; 6 -2.7,-2.54; 7 -2.7,-3.81; 8 2.7,-3.81; 9 2.7,-2.54; 10 2.7,-1.27; 11 2.7,0; 12 2.7,1.27; 13 2.7,2.54; 14 2.7,3.81
DFN6(3X3) = smd 0.55 x 0.5: 1 -1.3,0.95; 2 -1.3,0; 3 -1.3,-0.95; 4 1.3,-0.95; 5 1.3,0; 6 1.3,0.95 | smd 1.75 x 2.5: 7 0,0
8-SOIC = smd 1.55 x 0.6: 1 -2.7,1.905; 2 -2.7,0.635; 3 -2.7,-0.635; 4 -2.7,-1.905; 5 2.7,-1.905; 6 2.7,-0.635; 7 2.7,0.635; 8 2.7,1.905
SOT-363 = smd 0.9 x 0.4: 1 -1.1,0.65; 2 -1.1,0; 3 -1.1,-0.65; 4 1.1,-0.65; 5 1.1,0; 6 1.1,0.65
SOT-23-8 = smd 1.1 x 0.45: 1 -1.3,0.975; 2 -1.3,0.325; 3 -1.3,-0.325; 4 -1.3,-0.975; 5 1.3,-0.975; 6 1.3,-0.325; 7 1.3,0.325; 8 1.3,0.975
SOT-353 = smd 0.6 x 0.6: 1 -0.9,0.75; 3 -0.9,-0.75; 4 0.9,-0.75; 5 0.9,0.75 | smd 0.6 x 0.4: 2 -0.9,0
14-LGA = smd 1.145 x 0.55: 1 -1.1,2; 2 -1.1,1.2; 3 -1.1,0.4; 4 -1.1,-0.4; 5 -1.1,-1.2; 6 -1.1,-2; 8 1.1,-2; 9 1.1,-1.2; 10 1.1,-0.4; 11 1.1,0.4; 12 1.1,1.2; 13 1.1,2 | smd 0.55 x 1.145: 7 0,-2.1; 14 0,2.1
US8 = smd 1 x 0.3: 1 -1.4,0.75; 2 -1.4,0.25; 3 -1.4,-0.25; 4 -1.4,-0.75; 5 1.4,-0.75; 6 1.4,-0.25; 7 1.4,0.25; 8 1.4,0.75
16LFCSP = smd 1 x 0.35: 1 -1.9,0.975; 2 -1.9,0.325; 3 -1.9,-0.325; 4 -1.9,-0.975; 9 1.9,-0.975; 10 1.9,-0.325; 11 1.9,0.325; 12 1.9,0.975 | smd 0.35 x 1: 5 -0.975,-1.9; 6 -0.325,-1.9; 7 0.325,-1.9; 8 0.975,-1.9; 13 0.975,1.9; 14 0.325,1.9; 15 -0.325,1.9; 16 -0.975,1.9
16-LCC = smd 0.6 x 0.32: 1 -1.3,0.75; 2 -1.3,0.25; 3 -1.3,-0.25; 4 -1.3,-0.75; 9 1.3,-0.75; 10 1.3,-0.25; 11 1.3,0.25; 12 1.3,0.75 | smd 0.32 x 0.6: 5 -0.75,-1.3; 6 -0.25,-1.3; 7 0.25,-1.3; 8 0.75,-1.3; 13 0.75,1.3; 14 0.25,1.3; 15 -0.25,1.3; 16 -0.75,1.3
MICRO8 = smd 1.04 x 0.38: 1 -2.12,0.975; 2 -2.12,0.325; 3 -2.12,-0.325; 4 -2.12,-0.975; 5 2.12,-0.975; 6 2.12,-0.325; 7 2.12,0.325; 8 2.12,0.975
LGA-12_2X2X1_STM = smd 0.377 x 0.352: 1 -0.75,0.75; 2 -0.75,0.25; 3 -0.75,-0.25; 4 -0.75,-0.75; 7 0.75,-0.75; 8 0.75,-0.25; 9 0.75,0.25; 10 0.75,0.75 | smd 0.352 x 0.377: 5 -0.25,-0.75; 6 0.25,-0.75; 11 0.25,0.75; 12 -0.25,0.75

### Placement (x,y rotation side)
C1  78,28.6 0 top
C2  81,28.6 180 top
C3  16,10.9 0 top
C4  12.3,3.4 0 top
C5  12.9,14.1 180 top
C6  18.3,3.5 180 top
C7  18.3,1.4 180 top
C8  66.3,22.9 270 top
C9  70.5,22.9 270 top
C10  24.3,12.5 0 top
C11  27.3,12.6 90 top
C12  16.6,16.6 90 top
C13  16.5,19.2 180 top
C14  28.2,8.4 0 top
C15  22.2,17.4 90 top
C16  79.5,37.2 0 top
C17  86,8.4 0 top
C18  85,14 0 top
C19  62.7,15.5 180 bottom
C20  36.5,15.5 90 bottom
C21  38.8,2.7 180 bottom
C22  64.7,11.5 90 top
C23  66.8,11.5 90 top
C24  58.4,5.3 180 top
C25  54.8,8.5 270 top
C26  48.7,15.5 180 bottom
C27  76.8,19.3 180 bottom
C28  70.2,16.8 180 bottom
C29  50.6,11.5 90 top
C30  78.5,7.3 0 top
C31  40.7,8.5 270 top
C32  78.5,15.5 0 top
C33  40,38.2 180 bottom
C34  41,19.02 0 bottom
C35  44.1,20.9 270 bottom
C36  50.4,25.1 180 bottom
C37  57.58,18.82 180 bottom
C38  56.7,22.2 270 bottom
C39  43.6,44.4 0 bottom
C40  57.48,31 180 bottom
C41  57.2,35.18 270 bottom
C42  45,31.4 180 bottom
C43  44.1,34.9 270 bottom
C44  15.6,37.4 90 top
C45  12.2,27.5 270 top
C46  22.3,38.2 90 top
C47  3.2,16.9 90 top
C48  11.7,22 0 top
C49  17.1,23.7 270 top
C50  4.7,22 180 top
C51  3.6,27.5 270 top
C53  1.8,35.1 90 top
C54  20.9,23.7 90 top
C55  29.1,21.9 270 top
C56  79.5,31.2 0 top
CN1  6.2,10.8 0 top
D1  75.1,28.6 0 top
D2  12.3,1.2 0 top
D3  1,13.2 90 top
D4  8,2.2 270 top
D5  18.1,12.6 180 top
D6  23.8,3.3 180 top
D7  43.9,3.2 180 top
D8  88.1,15.2 270 top
D9  23.7,7.1 0 top
D10  24.9,16.9 90 top
D11  32,20.2 270 top
D12  26.2,7.2 180 top
D13  19,19.2 180 top
D14  35,20.2 270 top
D15  89.3,12 90 top
D16  70.2,7 180 top
D17  71.5,15.8 180 top
FB1  19.6,21.1 0 top
J1  85,34.2 90 top
J2  85,27.2 90 top
J4  85,20.2 90 top
J5  33.5,5 0 top
J6  27.5,5 0 top
J7  16,41 180 top
J8  10,41 180 top
L1  18.8,7.2 0 top
R1  3,7.2 0 top
R2  1,9.9 270 top
R3  12.9,12 180 top
R4  20,10.9 0 top
R5  12.9,9.9 0 top
R6  47,3.2 0 top
R7  64.2,22.9 90 top
R8  85,16.1 180 top
R9  68.4,22.9 90 top
R10  32,23.2 90 top
R11  35,23.2 90 top
R12  59.7,15.5 180 top
R13  30,15.5 90 bottom
R14  32.6,7.4 0 top
R15  32.3,15.5 270 bottom
R16  52.7,12.5 90 top
R17  61.7,7.5 0 top
R18  54.8,12.5 270 top
R19  52.7,9.5 90 top
R20  57.9,7.5 0 top
R21  45.6,15.5 180 top
R22  76.8,21.6 180 top
R23  76.8,23.7 0 top
R24  73.4,6 90 top
R25  70.8,19.5 180 top
R26  38.6,12.5 90 top
R27  47.7,7.5 0 top
R28  40.7,12.5 270 top
R29  38.6,9.5 90 top
R30  73.7,16.8 270 top
R31  43.7,7.5 0 top
R32  73.8,19.5 180 top
R33  19,39.2 180 top
R34  9,30 90 top
R35  9,26.9 90 top
R36  19,31.2 180 top
R39  6.9,30 90 top
R40  6.9,26.9 90 top
R45  11.4,37.2 270 top
R46  26.9,21.9 90 top
R47  6.5,39.7 180 top
R48  1.8,38.1 90 top
U1  13.8,7.2 0 top
U2  52,34.2 270 top
U3  24.6,9.5 0 top
U4  19.4,16.5 90 top
U5  73,34.2 270 top
U6  86,11.2 270 top
U7  59.7,11.5 0 top
U8  33.2,11.2 0 top
U9  38.1,6.2 90 top
U10  45.7,11.5 0 top
U11  73.4,22.6 270 top
U12  71.5,11.4 90 top
U13  39.5,38.3 270 top
U14  40.71,20.91 180 top
U15  47,23.6 0 top
U16  53.29,20.91 180 top
U17  53.29,33.49 180 top
U18  48.1,44.7 180 top
U19  40.71,33.49 180 top
U20  19,35.2 270 top
U21  8.2,18 180 top
U22  18.9,27.2 0 top
U23  6.6,35.7 180 top
U24  24.1,21.9 270 top
U25  -3,-12.8 0 top  (outside the outline)
U$2  [ROBOBUZZ_0.6X]  29,29.2 0 top

### Tracks (layer width: path | path; a pad name or v marks a point on that pad's centre or on a via)
1.6V_REF  (via drill 0.35)
  Top 0.2: U8.5 35.86,9.34 33.96,9.34 v32.1,11.2
  Bottom 0.2: v32.1,11.2 32.3,11.4 R15.2 R13.1
1.66V_REF_BUF
  Top 0.152: C24.2 56.6,5.3 C25.2
  Top 0.2: U8.7 U8.6 36.73,10.56 38.6,8.69 R29.1 39.75,8.65 40.7,7.7 C31.2 40.9,7.3 | R20.1 55.1,7.5 54.9,7.3 | C25.2 54.95,7.25 54.9,7.3 | 54.9,7.3 53.55,8.65 R19.1 52.7,8.35 51.07,6.72 41.48,6.72 40.9,7.3 | R31.1 41.1,7.5 40.9,7.3
3.3V  (via drill 0.35)
  Top 0.2: v49.5,24.04 49.19,24.35 U15.8 | v55.6,18.77 55.56,18.81 54.49,18.81 U16.1 | R11.2 v35,25.2 | v75.65,20.37 74.72,21.3 U11.8 | D1.C2 C1.1 77.15,26.81 U2.3.3V2 | U13.4 38.75,37.35 39.3,36.8 v39.3,36.6 | U12.8 69.59,15.4 v69.5,15.5 | v55.6,23.1 55.41,22.91 U16.6 | v43.34,23.14 43.11,22.91 U14.6 | v55.51,31.11 55.11,31.51 54.41,31.51 U17.1 | v55.6,35.6 55.53,35.53 54.43,35.53 U17.6 | v43,31.1 43,31.2 42.7,31.5 U19.1 | U19.6 41.83,35.47 41.86,35.5 42.7,35.5 v43,35.8 | v45.6,43.9 45.65,43.95 U18.8 46.7,42 46.52,41.82 U2.3.3V1 | U14.1 42.71,18.91 43,18.62 v43,18.52 | U5.1 77.11,37.2 C16.1 78.65,37.55 78.2,38 v77.6,38 | U5.8 v68.3,31.5
  Bottom 0.2: v49.5,24.04 49.5,24.66 49.8,24.86 49.55,24.99 C36.1 | C28.1 69.5,16.65 v69.5,15.5 | v75.65,20.37 75.65,19.6 C27.1 | C37.1 56.68,18.77 v55.6,18.77 | C38.1 56.65,23.1 v55.6,23.1 | C35.1 44.1,22.35 43.34,23.11 v43.34,23.14 | C40.1 56.52,31.11 v55.51,31.11 | C41.1 56.03,36.03 v55.6,35.6 | C42.1 43.85,31.1 v43,31.1 | C43.1 44.05,35.8 v43,35.8 | C33.1 39.3,38.05 v39.3,36.6 | C39.1 45.1,44.4 v45.6,43.9 | v43,18.52 42.5,19.02 C34.1
  pour Power (no thermals): 34,46 34,17.2 66,17.2 66,13.2 78,13.2 78,46
3V3_LED_CLK
  Top 0.2: U5.4 73,40.44 U2.2
3V3_LED_DATA
  Top 0.2: U5.3 74.27,39.97 76.12,41.82 U2.1
3V3_RC_SIGNAL
  Top 0.2: U5.2 75.54,38.8 78.56,41.82 U2.0
5V  (via drill 0.35)
  Top 0.2: U10.8 v48.4,14.4 | U2.5V 82,28.45 C2.1 81.85,29.6 81.25,30.2 79,30.2 78.65,30.55 C56.1 77.11,31.2 U5.14 | D9.2 25.1,7.1 v25.2,7.2 D12.C2 | R6.2 v49,3.2 | C11.1 27.3,10.7 27.05,10.45 | D10.1 24.9,15.8 v24.3,15.2 | v35.4,14.5 35.9,14 U8.8 | v37.93,4 38.1,4.17 U9.2 | v62,14.4 62.4,14 U7.8
  Top 0.3: C12.1 17.2,15.15 18.4,15.15 | U4.1 18.45,15.65 19,16.2 21,16.2 22,15.2 | U4.3 22,15.2 | 22,15.2 v24.3,15.2 | U3.5 27.05,10.45 v27.1,10.5
  Top 0.4: U4.1 18.4,15.15
  Power 0.2: U2.5V 82,31.5 82.7,32.2 v84,32.2
  Bottom 0.2: R13.2 29.95,16.3 v28.8,16.3 | C20.1 35.55,14.65 v35.4,14.5 | C21.1 37.95,3.98 v37.93,4 | C26.1 48.4,14.95 v48.4,14.4 | C19.1 61.85,14.55 v62,14.4
  pour Power (no thermals): 24,0 24,16.6 65.4,16.6 65.4,12.6 83,12.6 83,0
  pour Power (no thermals): 78.6,12.2 78.6,28.2 83,28.2 83,12.2
  pour Top (no thermals): 90,37.6 83.5,37.6 83.5,31.2 90,31.2
5V_LED_CLK  (via drill 0.35)
  Top 0.2: U5.11 73,30.11 v72.99,30.1 | v86.39,26.71 J2.2 | v86.4,19.7 J4.2
  Bottom 0.2: v72.99,30.1 73.36,30.1 75.85,27.61 85.49,27.61 v86.39,26.71 v86.39,19.71 v86.4,19.7
5V_LED_DATA  (via drill 0.35)
  Top 0.2: U5.12 74.27,30.13 v74.3,30.1 | J2.3 85.01,27.69 v87,27.69 87,21.8 85.87,20.67 85.03,20.67 J4.3
  Bottom 0.2: v74.3,30.1 76.31,28.09 86.6,28.09 v87,27.69
5V_RC_SIGNAL
  Top 0.2: U5.13 75.54,32.53 76.21,33.2 J1.1
9V  (via drill 0.35, 0.5)
  Top 0.2: D2.2 13.63,0.53 v14,0.53 | v85,7.1 87.9,7.1 89.3,8.5 D15.1 | U6.6 85.35,8.3 85.05,8.3 | D6.C2 19.9,3.3 C6.1
  Top 0.3: J5.1 v31.6,5 | J6.1 26.4,4.9 v25.6,4.9
  Top 0.4: R3.1 C5.1 v14.9,14.1
  Top 0.5: v85,7.1 85.05,7.15 85.05,8.3 C17.1 85.05,8.5 U6.4
  Power 0.4: v14.9,14.1 15.79,13.21 v20.09,13.21
  Bottom 0.2: v14,0.53 22.33,0.53 v22.8,1
  Bottom 0.3: v31.6,5 31.5,4.9 v25.6,4.9 v22.5,4.9
  Bottom 0.5: v22.8,1 79,1 85,7 v85,7.1
  pour Top (no thermals): 23.5,0 23.5,14.5 19,14.5 19,0
10K_FB
  Top 0.2: R17.2 62.6,7.45 66.27,7.45 68.03,9.21 68.03,12.29 67.42,12.9 C23.2 C22.2 63.94,12.13 U7.7
10K_IN
  Top 0.2: R16.1 R19.2 53.15,9.9 C25.1 55.77,10.86 U7.3 58.43,10.86 60.85,8.44 R17.1 60.85,6.35 C24.1
10K_INT  (via drill 0.35)
  Top 0.2: U11.7 73.72,22.55 v73.84,22.66 | R22.1 78.6,21.6 v78.8,21.4
  Bottom 0.2: v78.8,21.4 75.1,21.4 v73.84,22.66 73.84,25.2 73.84,26.04 U2.23
10K_OUT  (via drill 0.35)
  Top 0.2: R18.1 54.85,13.4 U7.1 58.1,13.4 58.85,14.15 R12.2 58.85,15.87 59.26,16.28 64.92,16.28 v66,15.2 | U12.3 72.14,9.56 71.5,10.2 v71,10.2
  Power 0.2: v66,15.2 v71,10.2
10K_PEAK  (via drill 0.35)
  Top 0.2: U12.2 D16.1 | D16.1 73.25,7 R24.2 73.5,6.75 75.45,6.75 C30.1 81.72,13.02 81.72,22.23 80.25,23.7 R23.2 | D16.1 70.86,6.16 v70.7,6
  Bottom 0.2: v70.7,6 68.5,8.2 68.5,25.2 67.12,26.58 U2.20
10K_REF
  Top 0.2: 66.9,25.53 65.18,25.53 64.2,24.55 R7.2 | 66.9,25.53 73,25.53 73.72,24.8 U11.2 | C8.1 66.3,24.93 66.9,25.53
20K_FB
  Top 0.2: U10.7 49.84,12.13 C29.2 51.5,12.9 51.92,12.48 51.92,8.5 50.92,7.5 R27.2
20K_IN
  Top 0.2: R26.1 R29.2 39.05,9.9 C31.1 41.66,10.86 U10.3 44.38,10.86 46.85,8.4 R27.1
20K_INT  (via drill 0.35)
  Top 0.2: R32.1 74.52,19.5 73.54,20.48 72.7,20.48 | v70.5,20.9 70.92,20.48 72.7,20.48 | U11.6 73.08,20.86 72.7,20.48
  Bottom 0.2: v70.5,20.9 70.5,25.2 70.5,25.24 U2.22
20K_OUT  (via drill 0.35)
  Top 0.2: R28.1 40.76,13.4 U10.1 44,13.4 44.75,14.15 R21.2 45.91,16.66 65.43,16.66 v67.8,14.3 | U12.5 73.41,13.1 73.07,12.77 v72,12.77
  Power 0.2: v67.8,14.3 69.33,12.77 v72,12.77
20K_PEAK  (via drill 0.35)
  Top 0.2: D17.1 73.55,15.8 R30.2 73.8,15.85 75.65,15.85 C32.1 | U12.6 72.14,15.77 D17.1 | D17.1 72.16,17.59 70.25,19.5 R25.2 69.2,20.25 v69.2,21
  Bottom 0.2: v69.2,21 69.2,26.5 69.28,26.58 U2.21
20K_REF
  Top 0.2: U11.4 70.75,23.9 C9.1 R9.2
+3V3  (via drill 0.35)
  Top 0.152: v13.9,36.6 15.55,36.6 C44.1 16.75,36.55 17.1,36.2
  Top 0.2: R46.1 v26.9,19.9 | R10.2 v32,25.2 | v21.64,21.14 21.6,21.1 FB1.2 | v24.9,18.4 D10.2 | U21.8 3.24,16.09 C47.1 2.15,16.05 v2.1,16 | U22.4 17.6,25 17.2,24.6 17.15,24.6 C49.1 16.05,24.55 v16,24.5 | v23.4,37.2 22.45,37.2 | 22.45,37.2 C46.1 | U20.16 20.9,36.48 21.62,37.2 22.45,37.2 | U20.5 17.1,36.2 | U23.8 2.26,33.8 C53.1 0.75,34.25 v0.67,34.17 | R45.1 11.45,38 v12.6,38
  pour Power (no thermals): 0,46 0,14.9 23.4,14.9 23.4,17.2 33.4,17.2 33.4,46
+5V
  pour Top (no thermals): 90,12.2 83.6,12.2 83.6,30.7 90,30.7
+24V
  pour Top (no thermals): 12.6,14 0,14 0,0 9.2,0 12.6,0
CS1
  Top 0.2: U14.7 40.71,23.61 40.95,23.85 43.65,23.85 | 43.65,23.85 U15.2 | 43.65,23.85 45.37,25.57 50.57,25.57 51.52,26.52 U2.14
CS2
  Top 0.2: U16.7 53.29,24.38 | U2.15 54.06,25.15 53.29,24.38 | 53.29,24.38 52.5,23.59 50.03,23.59 49.8,23.36 U15.6
CS3
  Top 0.2: U18.2 51.43,44.45 U2.10 54.06,39.82 53.29,39.05 U17.7
CS4
  Top 0.2: U18.6 43.05,44.95 41.36,43.26 U2.25 41.71,41.47 41.71,36.67 40.71,35.69 U19.7
ESC_L
  Top 0.2: U2.29 29.82,43.2 11,43.2 10.5,42.7 J8.1
ESC_R  (via drill 0.35)
  Top 0.2: J7.2 15.5,42.2 16.15,42.85 27.05,42.85 v27.39,42.51
  Power 0.2: U2.24 42.87,42.85 27.73,42.85 v27.39,42.51
ESC_TEL_L
  Top 0.2: U2.28 32.01,43.55 10.75,43.55 9.5,42.3 J8.2
ESC_TEL_R
  Top 0.2: U2.34 25,27.7 25,39 21.8,42.2 16.9,42.2 16.5,41.8 J7.1
GND  (via drill 0.35, 0.5)
  Top 0.152: 78.85,28.5 C1.2
  Top 0.2: U10.4 44.11,9.59 v44.4,9.3 | U7.4 58.11,9.59 v58.4,9.3 | v31.9,9.3 U8.4 | U12.4 v74.3,8.7 | v74.9,17.5 74.7,17.7 73.75,17.7 R30.1 | R24.1 73.35,5.1 v72.2,5.1 | v71.6,22.7 70.95,22.05 C9.2 | C2.2 79.46,27.91 U2.GND2 79.46,27.89 78.85,28.5 | U24.1 25.07,25.22 25.16,25.3 v25.2,25.3 | C55.2 29.1,20 v28.9,19.8 | U22.11 20.73,27.45 v21.08,27.8 | U22.7 19.15,24.23 v18.92,24 | U22.6 18.65,25.05 v18.3,24.7 | U22.13 19.65,29.15 v19.9,29.4 | U22.15 18.65,29.55 v18.4,29.8 | U22.1 16.95,27.95 v16.7,28.2 | C12.2 16.45,17.3 v15.5,17.3 | C50.2 v3.3,20.5 | C48.2 v13.1,20.5 | R14.1 31.65,7.3 v30.6,7.3 | v39.6,5.1 U9.3 | C15.2 23.25,18.25 v23.3,18.2 | J1.3 v86.4,35.2 | v43.02,34.6 42.94,34.69 U19.5 | v43,33.7 42.8,33.9 U19.4 | v43,32.27 41.8,32.27 U19.2 | v55.7,33.5 55.48,33.5 55.09,33.89 U17.4 | U14.5 42.79,22.11 42.9,22 v43,22 | v43,21.1 42.92,21.1 42.71,21.31 U14.4 | U14.2 v43,19.7 | v55.6,19.9 55.4,19.7 U16.2 | v55.51,20.9 55.46,20.9 55.05,21.31 U16.4 | v55.6,21.9 55.39,22.11 U16.5 | v55.7,34.4 55.41,34.69 U17.5 | U17.2 v55.7,32.3 | U15.4 44.55,22.85 v44.5,22.9 | v50.6,45.4 50.55,45.45 U18.4 | v67.3,22.93 67.3,22.43 66.92,22.05 C8.2 | D7.C 43,3.18 v43,2.1 | D11.C v32,18.2 | D14.C v35,18.2 | D8.C 88.1,13.3 v88,13.2 | D1.C1 v73.9,28.6 | D13.C1 v20,19.2 | D12.C1 26.7,7.2 v27.3,6.59 | U13.2 v39.5,40.1 | C47.2 v3.2,18.9 | C49.2 v18.25,22.85 | D3.C v1,15.2 | C11.2 27.3,14.5 v27.4,14.6 | C10.2 25.15,13.35 v25.4,13.6 | D5.C 17.22,13.98 v17.2,14 | C14.2 29.05,7.45 v29.2,7.3 | C13.2 15.65,20.25 v15.7,20.3 | U11.5 72.33,21.2 v71.62,21.2 | U21.4 v12.29,19.91 v12.3,19.9 | U23.6 U23.5 3.8,37.7 v3.8,38.5 | v15.1,39.4 15.6,38.9 C44.2 | v22.3,40.2 C46.2 | U20.8 17.08,34.2 v16,34.2 | v22,34.2 20.93,34.2 U20.13
  Top 0.2: C53.2 0.68,35.95 v0.65,35.98 | R48.2 0.65,38.95 v0.6,39 | U23.4 9.3,38.4 v9.2,38.5 | R47.2 v4.5,39.7 | C16.2 v81.51,37.2 | v81.41,32.1 80.81,32.1 80.35,31.64 C56.2 | U5.7 v68.3,36.9
  Top 0.3: J6.3 29.2,5.7 v29.4,5.7 | J5.3 35.16,5.66 v35.4,5.66 | J4.4 v83.5,21.7 | v86.4,28.7 J2.4 | C18.2 v87,14 | U4.2 19.4,14.1 v19.3,14
  Top 0.4: U3.2 v24.5,9.5 | U6.1 86.95,12.15 U6.7
  Top 0.5: CN1.2 v7.2,12.4 | D4.2 v8,0.6
  Bottom 0.2: C36.2 51.27,25.08 v52.45,25.08 | R15.1 31.65,16.35 31.2,16.8 v31.2,17 | C20.2 36.5,17.3 v36.3,17.5 | C21.2 40.7,2.7 v40.8,2.8 | C26.2 50.37,15.5 v50.7,15.83 | C19.2 63.51,15.46 63.51,14.66 v63.21,14.36 | C28.2 70.14,17.71 v70.14,17.84 | C38.2 v56.7,20.2 | v59.6,18.8 59.58,18.82 C37.2 | C34.2 40.15,18.92 39.55,18.32 v39.55,17.62 | C35.2 45.15,20.05 v45.2,20 | C41.2 v57.2,33.2 | v59.5,31 C40.2 | C43.2 v44.1,32.9 | v47,31.41 v46.99,31.4 C42.2 | C33.2 41.11,37.94 v41.11,37 | C39.2 v41.6,44.4 | C27.2 v78.8,19.3
  other vias: 14.2,5.3 15.3,5.3 15.3,4 15.3,2.9 14,1.9 15.3,1.4 84,11.2 88,11.2 88,10.2 88,8.2 13,44.8
  pour GND (no thermals): 90,46 0,46 0,0 90,0
  pour Top (no thermals): 13.2,10.7 13.2,0 17.8,0 17.8,6.5 14.4,6.5 14.4,10.7
  pour Top (no thermals): 83.6,11.8 90,11.8 90,7.2 83.6,7.2
  pour Top (no thermals): 24,0 24,6.2 37,6.2 37,0
  pour Top (no thermals): 7.6,45.7 7.6,43.9 18.4,43.9 18.4,45.7
IR_BOTTOM
  Top 0.2: U9.6 36.72,7.3 36.04,6.62 28.33,6.62 27.55,5.85 27.55,5.05 J6.2
IR_SEL  (via drill 0.35)
  Top 0.2: v36.82,4.2 37.45,4.83 U9.1
  Bottom 0.2: v36.82,4.2 35.81,4.2 33.5,6.51 33.5,26.2 33.74,26.44 U2.37
IR_TOP
  Top 0.2: J5.2 33.57,5.07 33.57,5.77 34.1,6.3 38.27,6.3 38.75,6.78 U9.4
MAG_FILT_A  (via drill 0.35)
  Top 0.2: v12.2,26.2 C45.2 13.72,24.6 14.13,24.19 14.13,19.27 12.23,17.36 U21.2 U21.1
  Bottom 0.2: v12.2,26.2 13,25.4 20.09,25.4 22.64,27.95 35.29,27.95 36.28,26.96 U2.38
MAG_FILT_B  (via drill 0.35)
  Top 0.2: v4.2,26.2 3.6,25.6 C51.2 2.3,24.6 2.2,24.5 2.2,20.7 3.1,19.8 4.2,19.8 4.9,19.1 5.37,18.63 U21.6 U21.7
  Bottom 0.2: v4.2,26.2 4.83,26.83 12.53,26.83 13.57,25.8 19.99,25.8 22.47,28.28 37.5,28.28 38.82,26.96 U2.39
MISO  (via drill 0.35)
  Top 0.2: U17.12 51.51,32.29 50.8,33 v50.8,34.3 | U19.12 38.91,32.29 38.6,32.6 v38.4,32.6 | U16.12 51.1,19.7 v51,19.8 | v37.2,18.9 37.27,18.97 37.27,23.02 | 37.27,23.02 37.27,29.77 v37.3,29.8 | U14.12 39.01,19.71 38.53,20.19 38.53,21.76 37.27,23.02
  Bottom 0.2: U2.12 48.77,41.23 48.77,37.53 | 48.77,37.53 48.77,36.33 v50.8,34.3 | 48.77,37.53 48.24,37 42.79,37 v38.4,32.61 v38.4,32.6 37.6,31.8 37.6,30.1 v37.3,29.8 | v51,19.8 48.92,19.8 45.97,16.84 39.27,16.84 v37.21,18.9 v37.2,18.9
MOSI  (via drill 0.35)
  Top 0.2: U18.5 47.33,45.45 48.91,43.87 49.42,43.87 U18.1 50.85,43.95 51.52,43.28 U2.11 | U15.5 47.24,22.85 46.58,23.52 46.58,24.01 46.24,24.35 U15.1 45.7,24.35 46.25,24.9 v46.7,24.9
  Bottom 0.2: v46.7,24.9 46.7,25.22 47.63,26.15 47.63,27.01 51.52,30.9 U2.11
MOSI1  (via drill 0.35)
  Top 0.2: U15.7 v47.26,23.85 v47.26,23.86 | U14.13 38.81,18.91 37.9,19.82 v37.9,21.5
  Bottom 0.2: v47.26,23.86 40.26,23.86 v37.9,21.5
MOSI2
  Top 0.2: U15.3 46.1,23.35 47.1,22.35 47.45,22.35 50.89,18.91 U16.13
MOSI3
  Top 0.2: U18.7 46.82,44.33 47.89,44.33 50.17,42.05 50.17,32.34 51.02,31.49 U17.13
MOSI4  (via drill 0.35)
  Top 0.2: U18.3 48.72,44.95 v48.19,45.48 | v37.53,35.13 37.53,32.57 38.61,31.49 U19.13
  Bottom 0.2: v48.19,45.48 47.9,45.2 38.9,45.2 37.53,43.83 v37.53,35.13
N$1
  Top 0.4: U1.6 14.9,10.65 C3.1
N$2
  Top 0.2: U12.1 69.59,7.05 D16.2
N$3
  pour Top (no thermals): 15.2,6.9 17.8,6.9 17.8,11.5 15.2,11.5
N$4
  Top 0.2: 60.43,13.25 60.43,11.75 61.34,10.86 U7.6 63.94,10.86 C22.1 C23.1 | 60.43,13.25 60.43,15.4 R12.1 | U7.2 59.34,12.13 60.43,13.25
N$5
  Top 0.2: R22.2 R23.1 74.58,23.7 U11.1
N$6  (via drill 0.35)
  Top 0.2: v71.82,24.9 72.72,24.9 73.08,24.54 U11.3 | R25.1 R32.2 72.95,18.65 v72.6,18.3
  Bottom 0.2: v71.82,24.9 72.22,24.5 72.22,22.97 72.23,22.96 72.23,18.67 v72.6,18.3
N$7  (via drill 0.35)
  Top 0.2: v54.1,14.5 53.72,14.12 53.72,12.66 54.73,11.65 R18.2 | v59.8,8.4 58.9,7.5 R20.2 | v60.4,9.9 60.7,9.59 U7.5
  Bottom 0.2: v54.1,14.5 59.7,14.5 60.4,13.8 v60.4,9.9 60.4,9 v59.8,8.4
N$8
  Top 0.2: U3.4 27.2,8.55 C14.1
N$9
  Top 0.2: U12.7 70.86,15.77 D17.2
N$10
  Top 0.2: R21.1 46.7,15.25 46.7,13.5 | 46.7,13.5 46.7,11.5 47.34,10.86 U10.6 49.84,10.86 C29.1 | U10.2 45.34,12.13 46.7,13.5
N$11
  Top 0.2: U4.4 20.95,17.8 C15.1
N$12
  Top 0.4: C5.2 R3.2 11.93,11.88 11.93,9.92 | R5.1 11.93,9.92 | U1.1 11.93,8.92 11.93,9.92
N$13  (via drill 0.35)
  Top 0.2: R28.2 39.7,12.65 v39.7,14.5 | v46.7,9.5 46.8,9.59 U10.5 | R31.2 v45.7,7.5
  Bottom 0.2: v39.7,14.5 40,14.8 45.4,14.8 46.7,13.5 v46.7,9.5 46.7,8.5 v45.7,7.5
N$14
  Top 0.2: R8.1 85.87,16.08 D8.A
N$15
  Top 0.2: R6.1 D7.A
N$16
  Top 0.2: U24.8 U24.7 U24.6 U24.5 23.12,22.2 22.56,22.76 22.48,22.85 C54.1
N$17
  Top 0.2: D11.A R10.1
N$18
  Top 0.2: R4.1 19.15,12.4 19.1,12.45 19.1,12.48 D5.A
N$19
  Top 0.2: R2.1 D3.A
N$20
  Top 0.2: R1.1 1.55,7.2 1,7.75 R2.2
N$21  (via drill 0.35)
  Top 0.2: v63,22.2 63.15,22.05 R7.1
  Bottom 0.2: v63,22.2 63,25.7 62.12,26.58 U2.18
N$22
  Top 0.2: R9.1 68.4,21.75 67.85,21.2 63,21.2 62.32,21.88 62.32,25.56 63.34,26.58 U2.19
N$23
  Top 0.2: R45.2 11.38,36.34 U23.3 8.27,36.34 7.35,37.25 R47.1
N$24
  Top 0.2: R48.1 1.82,37.23 2.19,37.23 2.6,36.82 2.6,35.34 2.87,35.06 U23.7
N$25
  Top 0.2: C45.1 10.95,29.15 R34.1 R35.2
N$26
  Top 0.2: R35.1 9,23.3 C48.1 9.8,21.5 9.8,19.3 9.95,19.15 10.47,18.63 U21.3
N$27
  Top 0.2: D14.A R11.1
N$28
  Top 0.2: U4.5 17.35,18.9 C13.1 | C13.1 17.35,20.45 18,21.1 FB1.1 | C13.1 D13.C2
N$29
  Top 0.2: C51.1 4.85,29.15 R39.1 R40.2
N$30
  Top 0.2: R40.1 6.9,22.8 C50.1 6.1,20.5 U21.5
N$31  (via drill 0.35)
  Top 0.2: v17.26,37.2 17.92,37.2 U20.4 | U22.3 16.25,26.95 v16,27.2
  Power 0.2: v16,27.2 16,28.44 16.6,29.05 16.6,36.55 v17.26,37.2
N$32  (via drill 0.35)
  Top 0.2: v20.74,37.2 20.07,37.2 U20.1 | U22.14 19.26,28.61 19.26,29.62 19.84,30.2 v21,30.2
  Bottom 0.2: v21,30.2 22,30.2 23.2,31.4 23.2,35.94 21.94,37.2 v20.74,37.2
N$33
  Top 0.2: U22.16 18.05,28.5 17,29.55 17,32.8 17.5,33.3 U20.9
N$34
  Top 0.2: U22.10 21.15,26.95 21.7,27.5 21.7,32.5 20.9,33.3 U20.12
N$35  (via drill 0.35)
  Top 0.2: U20.14 22.25,34.88 v22.57,35.2 | R39.2 6.9,31.9 v7,32
  Bottom 0.2: v7,32 7.1,31.9 18.8,31.9 22.1,35.2 v22.57,35.2
N$36  (via drill 0.35)
  Top 0.2: U20.15 21.52,35.52 22,36 v22,36.2 | v9.4,32.6 9,32.2 R34.2
  Bottom 0.2: v9.4,32.6 v9.41,32.59 18.52,32.59 22,36.08 v22,36.2
N$37
  Top 0.2: U20.3 18.67,38.67 R33.2
N$38
  Top 0.2: U20.2 19.33,38.67 R33.1
N$39
  Top 0.2: U20.10 18.67,31.73 R36.2
N$40
  Top 0.2: U20.11 19.33,31.73 R36.1
S/R
  Top 0.2: U24.4 23.12,26.12 U2.33 24.43,25.73 U24.2
S/R+
  Top 0.2: U22.8 19.65,25.2 20.3,24.55 C54.2
SCLK  (via drill 0.35)
  Top 0.2: U14.14 v40.7,17.6 | U2.13 48.98,29.28 49,29.3 | U17.14 53.29,30.99 52,29.7 49.4,29.7 49,29.3 | U19.14 40.71,30.99 42,29.7 48.6,29.7 49,29.3 | 49,29.3 | v48.58,20.32 48.68,20.32 50.67,18.32 53.1,18.32 53.29,18.51 U16.14
  Bottom 0.2: U2.13 48.58,26.18 v48.58,20.32 45.93,17.67 40.77,17.67 v40.7,17.6
TEMP
  Top 0.2: U13.3 38.75,41.75 U2.26
VG_SIGNAL
  Top 0.2: U9.5 38.08,7.32 38.08,7.64 37.55,8.17 33.9,8.17 | U8.3 31.53,10.56 33.91,8.18 33.9,8.17 | R14.2 33.45,7.72 33.86,8.13 33.9,8.17
VG_SIGNAL_BUF  (via drill 0.35)
  Top 0.2: U8.2 U8.1 30.5,14.4 31.3,15.2 38.6,15.2 v38.7,15.1 38.6,15 R26.2 | R16.2 52.65,13.35 v51.2,14.8
  Power 0.2: v51.2,14.8 50.8,15.2 38.8,15.2 v38.7,15.1
VREF/2
  Top 0.2: U23.1 U23.2 9.76,35.52 U20.6 U20.7
VSR
  Top 0.2: U24.3 23.81,23.99 23.81,23.41 24.46,22.75 R46.2 C55.1

### Text on the board
tPlace: 3V3 | 3.3V | 24V | 5V | 9V | 5V
bPlace: Hocki Control V2
tDocu: +